# EasyEDA Pro project Project-File_Cpeedo-mk5.epro, board PCB1
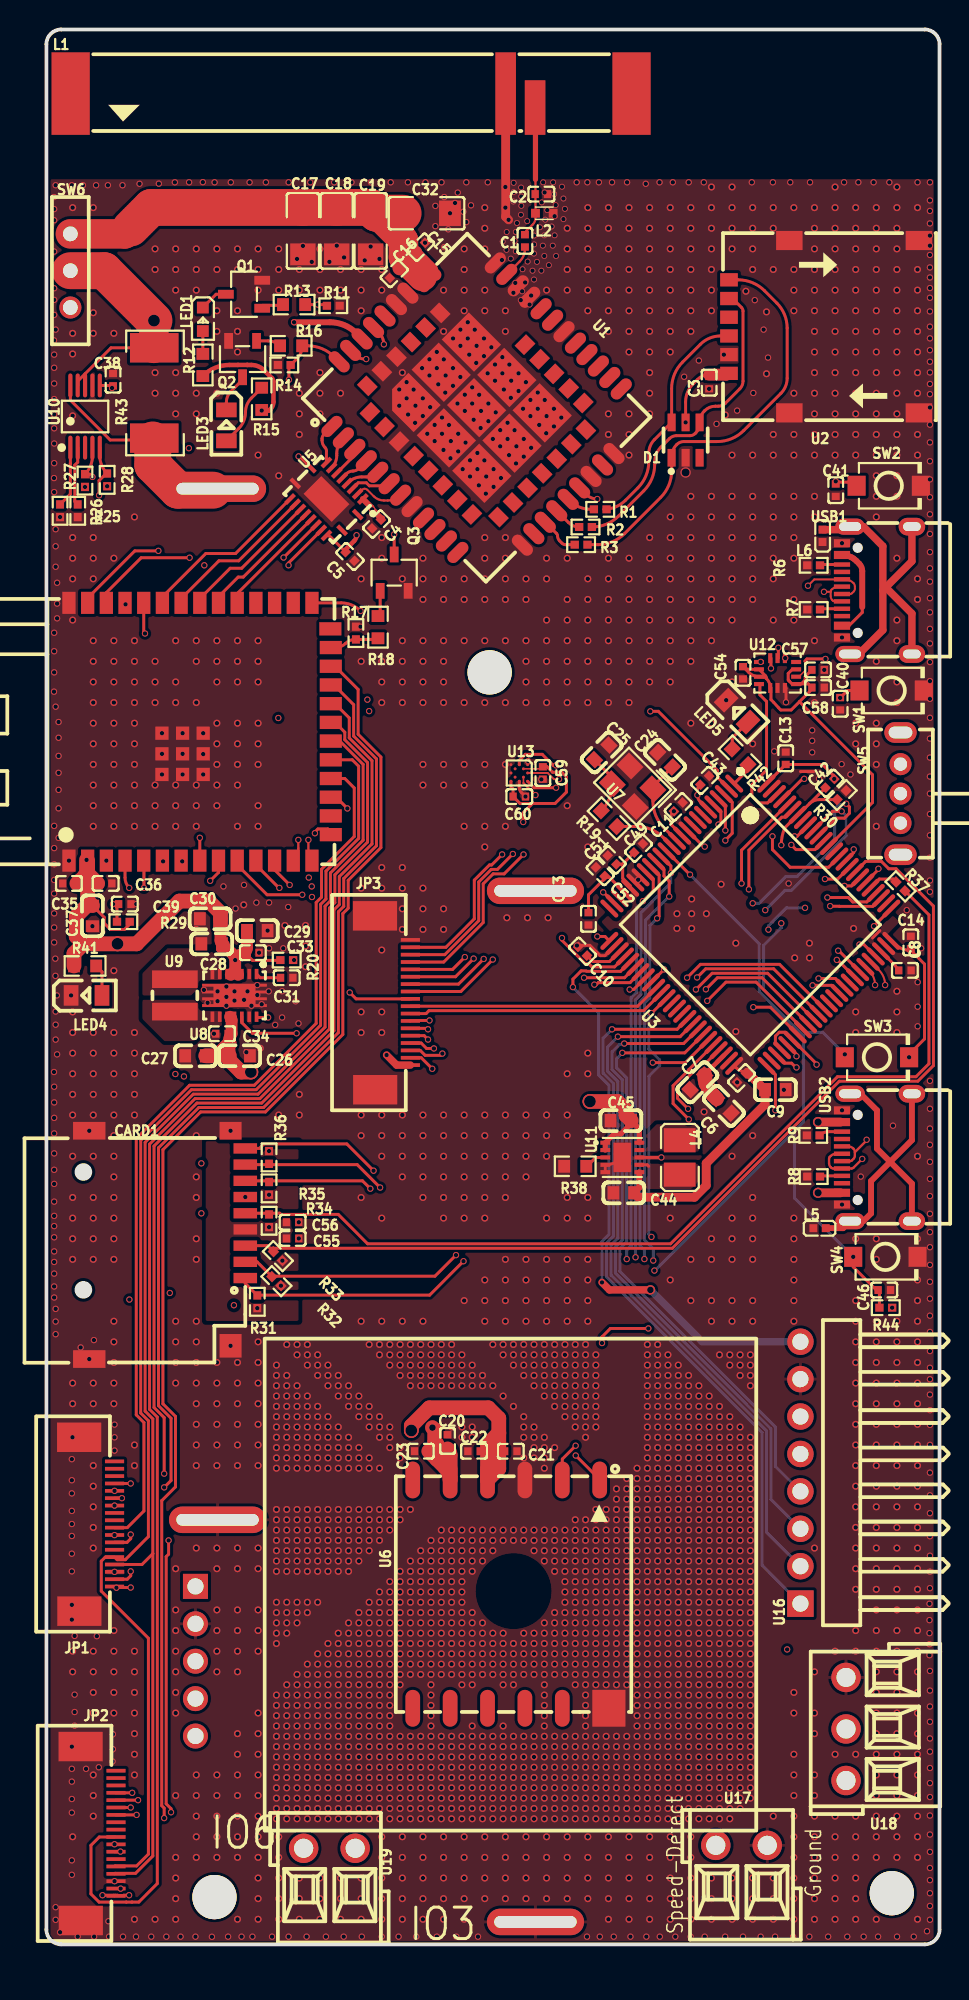
[diagram p5: board, top side]
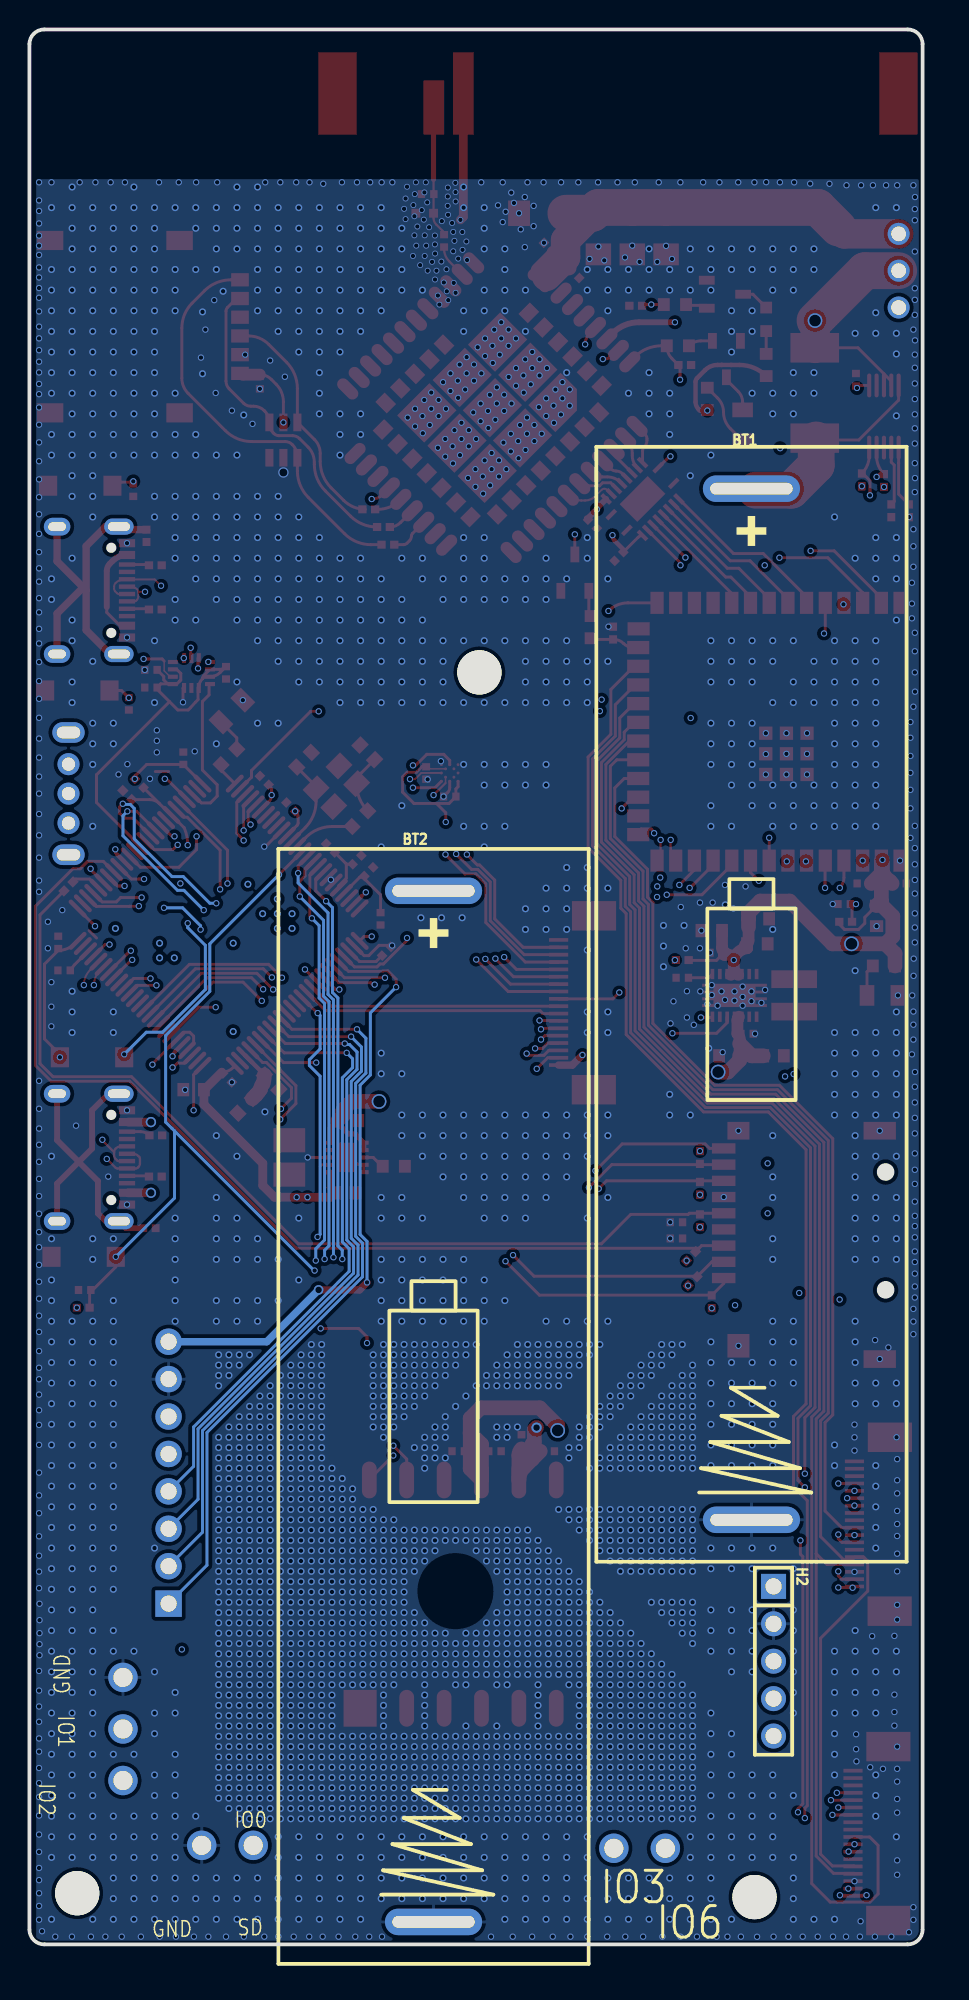
[diagram p6: board, bottom side, seen from below]

Outline 60.68 x 130 mm; copper layers: Top Layer, Inner1, Inner2, Inner3, Inner4, Bottom Layer. Coordinates in mm from the lower left corner of the outline.
Outline path: 0,129 0,1 arc(0.29,0.29) 1,0 59.68,0 arc(60.39,0.29) 60.68,1 60.68,129 arc(60.39,129.71) 59.68,130 1,130 arc(0.29,129.71) 0,129
Stack: Top Layer 0.035mm Outer layer thickness 1oz / Dielectric1 0.0994mm 3313 RC57% 4.2mil / Inner1 0.0152mm Inner layer thickness / Dielectric2 0.55mm 0.55mm H/H No copper / Inner2 0.0152mm Inner layer thickness / Dielectric3 0.1164mm 2116 RC54% 4.9mil / Inner3 0.0152mm Inner layer thickness / Dielectric4 0.55mm 0.55mm H/H No copper / Inner4 0.0152mm Inner layer thickness / Dielectric5 0.0994mm 3313 RC57% 4.2mil / Bottom Layer 0.035mm Outer layer thickness 1oz

## Design rules (mm)
net USB_ESP32_D-: DP1
net USB_ESP32_D+: DP1
net STM32_DN: DP2
net STM32_DP: DP2
template: Custom Config
spacing copperThickness1oz (default): track to track 0.102, other pairs 0.1 to 0.3
spacing copperThickness2oz: track to track 0.203, other pairs 0.152 to 0.3
track width copperThickness1oz (default): min 0.08, default 0.2, max 2.54
track width copperThickness2oz: min 0.203, default 0.254, max 2.54
differential pair differentialPair (default): width min 0.127, default 0.133, max 2.54; gap min 0.152, default 0.2
via viaSize (default): diameter min 0.4, default 0.43, max 10; hole min 0.3, default 0.3, max 6.3
pour e26 uses copperRegion1

## Placement (name value [footprint] x y rotation side)
BT1  BH-18650-A1AJ006  [BAT-TH_BH-18650-A1AJ006]  11.63 63.82 90 bottom
BT2  BH-18650-A1AJ006  [BAT-TH_BH-18650-A1AJ006]  33.23 36.52 90 bottom
C1  2.7pF  [C0402]  32.51 115.65 90 top
C2  0.5pF  [C0402]  33.63 118.82 180 top
C3  100nF  [C0402]  45.03 106.02 90 top
C4  100nF  [C0402]  22.43 96.42 45 top
C5  100nF  [C0402]  20.63 94.22 135 top
C6  2.2uF  [C0603]  46.03 56.92 135 top
C7  2.2uF  [C0603]  44.23 58.52 45 top
C8  100nF  [C0402]  58.33 66.12 180 top
C9  10uF  [C0603]  49.53 58.02 180 top
C10  100nF  [C0402]  36.43 67.42 315 top
C11  100nF  [C0402]  42.93 77.22 225 top
C12  100nF  [C0402]  47.23 58.82 45 top
C13  100nF  [C0402]  50.23 80.52 270 top
C14  100nF  [C0402]  58.73 68.02 270 top
C15  100nF  [C0402]  25.43 115.22 225 top
C16  1uF  [C0402]  23.63 113.42 45 top
C17  100uF  [C1206]  17.43 116.32 90 top
C18  100uF  [C1206]  19.73 116.32 90 top
C19  100uF  [C1206]  22.03 116.32 90 top
C20  100nF  [C0402]  27.25 34.18 270 top
C21  100nF  [C0402]  31.55 33.48 180 top
C22  10uF  [C0402]  29.05 33.48 0 top
C23  4.7uF  [C0402]  25.43 33.48 0 top
C24  15pF  [C0603]  42.03 80.42 315 top
C25  15pF  [C0603]  37.73 80.92 225 top
C26  10uF  [C0603]  13.13 60.32 180 top
C27  10uF  [C0603]  10.13 60.32 0 top
C28  22uF  [C0603]  11.23 67.92 0 top
C29  22uF  [C0603]  14.33 68.82 180 top
C30  22uF  [C0603]  11.13 69.62 0 top
C31  100nF  [C0402]  16.33 65.62 180 top
C32  100uF  [C1206]  25.83 117.52 180 top
C33  100nF  [C0402]  14.03 67.32 180 top
C34  100nF  [C0402]  11.93 61.82 0 top
C35  100nF  [C0402]  1.53 72.02 0 top
C36  10uF  [C0402]  4.03 72.02 180 top
C37  22uF  [C0603]  3.13 69.82 90 top
C38  100nF  [C0402]  4.53 106.22 270 top
C39  1uF  [C0402]  5.33 70.62 180 top
C40  100nF  [C0402]  53.93 84.22 90 top
C41  100nF  [C0402]  53.63 98.72 90 top
C42  100nF  [C0402]  53.23 78.82 225 top
C43  100nF  [C0402]  44.73 79.02 225 top
C44  22uF  [C0603]  39.23 51.02 0 top
C45  10uF  [C0603]  39.03 55.92 0 top
C46  100nF  [C0402]  56.93 44.42 180 top
C49  1uF  [C0402]  40.23 74.42 225 top
C51  1uF  [C0402]  38.43 73.62 315 top
C52  100nF  [C0402]  37.63 72.82 135 top
C53  100nF  [C0402]  36.83 69.62 270 top
C54  100nF  [C0402]  47.33 86.32 90 top
C55  100nF  [C0402]  16.73 47.92 180 top
C56  1uF  [C0402]  16.73 49.02 180 top
C57  100nF  [C0402]  52.43 86.52 180 top
C58  2.2uF  [C0402]  52.43 85.32 180 top
C59  100nF  [C0402]  33.73 79.52 90 top
C60  100nF  [C0402]  32.13 77.92 180 top
CARD1  TF PUSH  [TF-SMD_TF-PUSH]  8.21 47.48 270 top
D1  SRV05-4  [SOT-23-6_L2.9-W1.6-P0.95-LS2.8-BL-1]  43.43 102.12 0 top
H2  PZ254V-11-05P  [HDR-TH_5P-P2.54-V-M]  10.13 19.22 270 bottom
JP1  AFC07-S18FCC-00  [FPC-SMD_AFC07-S18FCC-00]  3.43 28.52 270 top
JP2  AFC07-S18FCC-00  [FPC-SMD_AFC07-S18FCC-00]  3.53 7.52 270 top
JP3  AFC07-S18FCC-00  [FPC-SMD_AFC07-S18FCC-00]  23.53 63.92 270 top
L1  1462000001  [ANT-SMD_L40.0-W5.0_1462000001]  20.7 125.17 0 top
L2  7.5nH  [IND-SMD_L1.2-W0.6]  33.83 117.52 0 top
L4  2.2uH  [L1008]  43.03 53.42 270 top
L5  BLM15AX102SN1D  [L0402]  52.53 48.62 0 top
L6  BLM15AX102SN1D  [L0402]  52.73 95.62 90 top
LED1  KT-0603R  [LED0603-RD]  10.63 110.32 270 top
LED3  KT-0805G  [LED0805-R-RD]  12.23 103.12 270 top
LED4  KT-0805G  [LED0805-R-RD]  2.73 64.42 0 top
LED5  KT-0805G  [LED0805-R-RD]  46.93 83.72 315 top
NOREF  -  [Pad_e88905]  57.43 3.47 0 top
NOREF#2  -  [Pad_e88906]  11.42 3.21 0 top
NOREF#3  -  [Pad_e88904]  30.11 86.35 0 top
Q1  BSS138  [SOT-23-3_L2.9-W1.6-P1.90-LS2.8-BR]  13.43 112.02 0 top
Q2  BSS138  [SOT-23-3_L2.9-W1.6-P1.90-LS2.8-BR]  13.33 107.62 90 top
Q3  BSS138  [SOT-23-3_L2.9-W1.6-P1.90-LS2.8-BR]  23.63 93.12 270 top
R1  22Ω  [R0402]  37.63 97.42 180 top
R2  22Ω  [R0402]  36.63 96.22 180 top
R3  22Ω  [R0402]  36.33 95.02 180 top
R6  5.1kΩ  [R0402]  52.13 93.62 0 top
R7  5.1kΩ  [R0402]  52.13 90.62 0 top
R8  5.1kΩ  [R0402]  52.13 52.12 0 top
R9  5.1kΩ  [R0402]  52.1 54.92 0 top
R11  10kΩ  [R0402]  19.49 111.24 180 top
R12  680Ω  [R0603]  10.63 107.22 270 top
R13  680Ω  [R0603]  16.83 111.32 0 top
R14  10kΩ  [R0402]  16.16 107.22 0 top
R15  680Ω  [R0603]  14.63 104.92 270 top
R16  680Ω  [R0603]  16.63 108.52 0 top
R17  10kΩ  [R0402]  21.03 89.02 270 top
R18  680Ω  [R0603]  22.53 89.42 270 top
R19  1kΩ  [R0603]  38.23 76.42 315 top
R20  100kΩ  [R0402]  16.33 66.82 180 top
R25  10kΩ  [R0402]  0.93 97.32 90 top
R26  10kΩ  [R0402]  2.13 97.32 90 top
R27  10kΩ  [R0402]  2.62 99.38 270 top
R28  10kΩ  [R0402]  4.13 99.42 270 top
R29  10kΩ  [R0402]  5.23 69.42 180 top
R30  10kΩ  [R0402]  54.03 78.02 225 top
R31  10kΩ  [R0402]  14.33 43.62 270 top
R32  10kΩ  [R0402]  15.63 45.02 315 top
R33  10kΩ  [R0402]  15.73 46.72 315 top
R34  10kΩ  [R0402]  15.13 49.12 270 top
R35  10kΩ  [R0402]  15.13 51.32 270 top
R36  10kΩ  [R0402]  15.13 53.42 90 top
R37  33Ω  [R0402]  58.03 71.82 135 top
R38  36.5kΩ  [R0603]  35.93 52.82 0 top
R41  680Ω  [R0603]  2.63 66.42 0 top
R42  680Ω  [R0603]  47.13 80.62 135 top
R43  20mΩ  [RES-SMD_L6.4-W3.2-R2512]  7.33 105.32 270 top
R44  10kΩ  [R0402]  57.03 43.22 0 top
SW1  TS-1088-AR02016  [SW-SMD_L3.9-W3.0-P4.45]  57.43 85.12 0 top
SW2  TS-1088-AR02016  [SW-SMD_L3.9-W3.0-P4.45]  57.23 99.02 0 top
SW3  TS-1088-AR02016  [SW-SMD_L3.9-W3.0-P4.45]  56.43 60.22 0 top
SW4  TS-1088-AR02016  [SW-SMD_L3.9-W3.0-P4.45]  57 46.68 0 top
SW5  SK12D07VG4  [SW-TH_SK12D07VG4-1]  58.03 78.12 90 top
SW6  K3-1204D  [SW-TH_K3-1204D]  1.63 113.62 270 top
U1  SIM7080G  [LCC-SMD_SIM7080G]  29.23 104.32 45 top
U2  NANO SIM XG6P H1.35  [SIM-SMD_NANO-SIM-XG6P-H1.35]  52.83 109.82 90 top
U3  STM32U575VGT6  [LQFP-100_L14.0-W14.0-P0.50-LS16.0-BL]  47.83 69.22 225 top
U4  ESP32-S3-WROOM-1-N16R8  [WIRELM-SMD_ESP32-S3-WROOM-1]  10.43 82.32 90 top
U5  TXB0108RGYR  [VQFN-20_L4.5-W3.5-P0.50-BL-EP]  19.03 98.12 135 top
U6  L80RE-M37  [GPSM-SMD_12P-L16.0-W16.0-P2.54-BL]  31.55 23.78 180 top
U7  ABM8-272-T3  [CRYSTAL-SMD_4P-L3.2-W2.5-BL]  39.83 78.62 135 top
U8  TPS63021DSJR  [VSON-14_L4.0-W3.0-P0.50-BL-EP_TI_DSJ]  12.78 64.42 180 top
U9  1.5uH  [IND-SMD_L3.0-W3.0_FTC303020D]  8.73 64.42 90 top
U10  INA226AIDGSR  [MSOP-10_L3.0-W3.0-P0.50-LS5.0-BL]  2.63 103.72 0 top
U11  TPS63900DSKR  [WSON-10_L2.5-W2.5-W0.50-TL-EP]  39.13 53.42 0 top
U12  ICM-42688-PC  [LGA-14_L3.0-W2.5-P0.50-TL]  49.67 86.31 0 top
U13  BMM150  [WLCSP-12_L1.6-W1.6_BMM150]  32.13 79.52 0 top
U16  2541WR-08P  [HDR-TH_8P-P2.54-H-M-W10.4]  51.23 32.02 90 top
U17  KF350R-3.5-2P  [CONN-TH_P3.50_KF396R-3.5-2P]  47.23 6.72 0 top
U18  KF350R-3.5-3P  [CONN-TH_3P-P3.50_KF396R-3.5-3P]  54.33 14.62 90 top
U19  KF350R-3.5-2P  [CONN-TH_P3.50_KF396R-3.5-2P]  19.23 6.52 0 top
USB1  TYPE-C 16PIN 2MD(073)  [USB-C-SMD_TYPE-C-6PIN-2MD-073]  56.43 91.92 90 top
USB2  TYPE-C 16PIN 2MD(073)  [USB-C-SMD_TYPE-C-6PIN-2MD-073]  56.43 53.42 90 top

## Footprints (pads in the part's own frame, mm; a bottom-side part is the same pattern mirrored in y, then rotated)
ANT-SMD_L40.0-W5.0_1462000001
  rect 2.6x5.6 smd: 1(-19.054,0.475) 4(19.054,0.475)
  rect 1.4x5.6 smd: 2(10.5,0.475)
  rect 1.4x3.7 smd: 3(12.5,-0.475)
BAT-TH_BH-18650-A1AJ006
  oval 1.8x6.6 hole 0.8x5.6: 1(-35,0) 2(35,0)
C0402
  rect 0.5x0.54 smd: 1(-0.42,0) 2(0.42,0)
C0603
  rect 0.8x0.9 smd: 1(-0.7,0) 2(0.7,0)
C1206
  rect 1.485x1.728 smd: 1(-1.593,0) 2(1.593,0)
CONN-TH_3P-P3.50_KF396R-3.5-3P
  round 2 hole 1.3: 1(-3.5,0) 2(0,0) 3(3.5,0)
CONN-TH_P3.50_KF396R-3.5-2P
  round 2 hole 1.3: 1(-1.75,0) 2(1.75,0)
CRYSTAL-SMD_4P-L3.2-W2.5-BL
  rect 1.4x1.2 smd: 1(-1.1,-0.85) 2(1.1,-0.85) 3(1.1,0.85) 4(-1.1,0.85)
FPC-SMD_AFC07-S18FCC-00
  rect 0.25x1.3 smd: 1(4.231,1.202) 2(3.734,1.202) 3(3.234,1.202) 4(2.734,1.202) 5(2.234,1.202) 6(1.734,1.202) 7(1.232,1.204) 8(0.733,1.204) 9(0.233,1.203) 10(-0.267,1.203) 11(-0.765,1.202) 12(-1.266,1.202) 13(-1.768,1.202) 14(-2.266,1.202) 15(-2.766,1.202) 16(-3.266,1.202) 17(-3.766,1.202) 18(-4.268,1.202)
  rect 2x3 smd: 19(-5.904,-1.204) 20(5.904,-1.19)
GPSM-SMD_12P-L16.0-W16.0-P2.54-BL
  oval 1x2.5 smd: 1(-6.037,-7.75) 2(-3.498,-7.75) 3(-0.958,-7.75) 4(1.583,-7.75) 5(4.122,-7.75) 6(6.662,-7.75) 7(6.662,7.75) 8(4.122,7.75) 9(1.583,7.75) 10(-0.958,7.75) 11(-3.498,7.75)
  rect 2.25x2.5 smd: 12(-6.662,7.75)
HDR-TH_5P-P2.54-V-M
  rect 1.7x1.7 hole 1.1: 1(-5.08,0)
  round 1.7 hole 1.1: 2(-2.54,0) 3(0,0) 4(2.54,0) 5(5.08,0)
HDR-TH_8P-P2.54-H-M-W10.4
  rect 1.8x1.8 hole 1.1: 1(-8.89,0)
  round 1.8 hole 1.1: 2(-6.35,0) 3(-3.81,0) 4(-1.27,0) 5(1.27,0) 6(3.81,0) 7(6.35,0) 8(8.89,0)
IND-SMD_L1.2-W0.6
  rect 0.6x0.6 smd: 1(-0.6,0) 2(0.6,0)
IND-SMD_L3.0-W3.0_FTC303020D
  rect 1.2x3.1 smd: 1(-1.1,0) 2(1.1,0)
L0402
  rect 0.54x0.54 smd: 1(-0.42,0) 2(0.42,0)
L1008
  rect 1.635x2.16 smd: 1(-1.167,0) 2(1.167,0)
LCC-SMD_SIM7080G
  oval 1.7x0.8 smd: 1(-7.85,6.05) 2(-7.85,4.95) 3(-7.85,3.85) 4(-7.85,2.75) 5(-7.85,1.65) 6(-7.85,0.55) 7(-7.85,-0.55) 8(-7.85,-1.65) 9(-7.85,-2.75) 10(-7.85,-3.85) 11(-7.85,-4.95) 12(-7.85,-6.05) 22(7.85,-6.05) 23(7.85,-4.95) 24(7.85,-3.85) 25(7.85,-2.75) 26(7.85,-1.65) 27(7.85,-0.55) 28(7.85,0.55) 29(7.85,1.65) 30(7.85,2.75) 31(7.85,3.85) 32(7.85,4.95) 33(7.85,6.05)
  oval 0.8x1.7 smd: 13(-4.4,-8.8) 14(-3.3,-8.8) 15(-2.2,-8.8) 16(-1.1,-8.8) 17(0,-8.8) 18(1.1,-8.8) 19(2.2,-8.8) 20(3.3,-8.8) 21(4.4,-8.8) 34(4.4,8.8) 35(3.3,8.8) 36(2.2,8.8) 37(1.1,8.8) 38(0,8.8) 39(-1.1,8.8) 40(-2.2,8.8) 41(-3.3,8.8) 42(-4.4,8.8)
  rect 1.1x0.9 smd: 43(-5.35,4.9) 44(-5.35,3.5) 45(-5.35,2.1) 46(-5.35,0.7) 47(-5.35,-0.7) 48(-5.35,-2.1) 49(-5.35,-3.5) 50(-5.35,-4.9) 58(5.35,-4.9) 59(5.35,-3.5) 60(5.35,-2.1) 61(5.35,-0.7) 62(5.35,0.7)
  rect 0.9x1.1 smd: 51(-4.2,-6.3) 52(-2.8,-6.3) 53(-1.4,-6.3) 54(0,-6.3) 55(1.4,-6.3) 56(2.8,-6.3) 57(4.2,-6.3) 63(2.8,6.3) 64(1.4,6.3) 65(0,6.3) 66(-1.4,6.3) 67(-2.8,6.3) 68(-4.2,6.3)
  custom 2.6x3.1 smd: 69(-2.9,3.4)
  rect 2.6x3.1 smd: 70(-2.9,0) 71(-2.9,-3.4) 72(0,-3.4) 73(2.9,-3.4) 74(2.9,0) 75(2.9,3.4) 76(0,3.4) 77(0,0)
LED0603-RD
  rect 0.8x0.8 smd: 1(-0.799,0) 2(0.799,0)
LED0805-R-RD
  rect 1x1.399 smd: 1(1.05,0) 2(-1.05,0)
LGA-14_L3.0-W2.5-P0.50-TL
  rect 0.675x0.28 smd: 1(-1.262,0.75) 2(-1.262,0.25) 3(-1.262,-0.25) 4(-1.262,-0.75) 8(1.262,-0.75) 9(1.262,-0.25) 10(1.262,0.25) 11(1.262,0.75)
  rect 0.28x0.675 smd: 5(-0.5,-1.012) 6(0,-1.012) 7(0.5,-1.012) 12(0.5,1.012) 13(0,1.012) 14(-0.5,1.012)
LQFP-100_L14.0-W14.0-P0.50-LS16.0-BL
  oval 0.3x1.6 smd: 1(-6,-7.55) 2(-5.5,-7.55) 3(-5,-7.55) 4(-4.5,-7.55) 5(-4,-7.55) 6(-3.5,-7.55) 7(-3,-7.55) 8(-2.5,-7.55) 9(-2,-7.55) 10(-1.5,-7.55) 11(-1,-7.55) 12(-0.5,-7.55) 13(0,-7.55) 14(0.5,-7.55) 15(1,-7.55) 16(1.5,-7.55) 17(2,-7.55) 18(2.5,-7.55) 19(3,-7.55) 20(3.5,-7.55) 21(4,-7.55) 22(4.5,-7.55) 23(5,-7.55) 24(5.5,-7.55) 25(6,-7.55) 51(6,7.55) 52(5.5,7.55) 53(5,7.55) 54(4.5,7.55) 55(4,7.55) 56(3.5,7.55) 57(3,7.55) 58(2.5,7.55) 59(2,7.55) 60(1.5,7.55) 61(1,7.55) 62(0.5,7.55) 63(0,7.55) 64(-0.5,7.55) 65(-1,7.55) 66(-1.5,7.55) 67(-2,7.55) 68(-2.5,7.55) 69(-3,7.55) 70(-3.5,7.55) 71(-4,7.55) 72(-4.5,7.55) 73(-5,7.55) 74(-5.5,7.55) 75(-6,7.55)
  oval 1.6x0.3 smd: 26(7.55,-6) 27(7.55,-5.5) 28(7.55,-5) 29(7.55,-4.5) 30(7.55,-4) 31(7.55,-3.5) 32(7.55,-3) 33(7.55,-2.5) 34(7.55,-2) 35(7.55,-1.5) 36(7.55,-1) 37(7.55,-0.5) 38(7.55,0) 39(7.55,0.5) 40(7.55,1) 41(7.55,1.5) 42(7.55,2) 43(7.55,2.5) 44(7.55,3) 45(7.55,3.5) 46(7.55,4) 47(7.55,4.5) 48(7.55,5) 49(7.55,5.5) 50(7.55,6) 76(-7.55,6) 77(-7.55,5.5) 78(-7.55,5) 79(-7.55,4.5) 80(-7.55,4) 81(-7.55,3.5) 82(-7.55,3) 83(-7.55,2.5) 84(-7.55,2) 85(-7.55,1.5) 86(-7.55,1) 87(-7.55,0.5) 88(-7.55,0) 89(-7.55,-0.5) 90(-7.55,-1) 91(-7.55,-1.5) 92(-7.55,-2) 93(-7.55,-2.5) 94(-7.55,-3) 95(-7.55,-3.5) 96(-7.55,-4) 97(-7.55,-4.5) 98(-7.55,-5) 99(-7.55,-5.5) 100(-7.55,-6)
MSOP-10_L3.0-W3.0-P0.50-LS5.0-BL
  oval 0.28x1.62 smd: 1(-1,-2.11) 2(-0.5,-2.11) 3(0,-2.11) 4(0.5,-2.11) 5(1,-2.11) 6(1,2.11) 7(0.5,2.11) 8(0,2.11) 9(-0.5,2.11) 10(-1,2.11)
Pad_e88904
  round 3 hole 3: 1(0,0)
Pad_e88905
  round 3 hole 3: 1(0,0)
Pad_e88906
  round 3 hole 3: 1(0,0)
R0402
  rect 0.566x0.54 smd: 1(-0.433,0) 2(0.433,0)
R0603
  rect 0.806x0.864 smd: 1(-0.753,0) 2(0.753,0)
RES-SMD_L6.4-W3.2-R2512
  rect 2x3.3 smd: 1(-3.067,0) 2(3.067,0)
SIM-SMD_NANO-SIM-XG6P-H1.35
  rect 0.9x1.2 smd: 1(-3.17,6.45) 2(-0.63,6.45) 3(1.91,6.45) 5(-1.9,6.45) 6(0.64,6.45) 7(3.18,6.45)
  rect 1.3x1.8 smd: 8(-5.85,2.35) 9(-5.85,-6.45) 10(5.85,-6.45) 11(5.85,2.35)
SOT-23-3_L2.9-W1.6-P1.90-LS2.8-BR
  rect 1.07x0.6 smd: 1(1.235,-0.95) 2(1.235,0.95) 3(-1.235,0)
SOT-23-6_L2.9-W1.6-P0.95-LS2.8-BL-1
  rect 0.55x1.2 smd: 1(-0.95,-1.2) 2(0,-1.2) 3(0.95,-1.2) 4(0.95,1.2) 5(0,1.2) 6(-0.95,1.2)
SW-SMD_L3.9-W3.0-P4.45
  rect 1.23x1.36 smd: 1(-2.185,0) 2(2.185,0)
SW-TH_K3-1204D
  round 1.5 hole 1: 1(-2.5,0) 2(0,0) 3(2.5,0)
SW-TH_SK12D07VG4-1
  round 1.5 hole 0.9: 1(-2,0) 2(0,0) 3(2,0)
  oval 1.4x2.2 hole 0.8x1.6: 4(4.15,0) 5(-4.15,0)
TF-SMD_TF-PUSH
  rect 0.7x1.6 smd: 1(2.25,5.3) 2(1.15,5.3) 3(0.05,5.3) 4(-1.05,5.3) 5(-2.15,5.3) 6(-3.25,5.3) 7(-4.35,5.3) 8(-5.45,5.3) CD(-6.55,5.3)
  rect 1.2x1.5 smd: 10(-7.75,4.3)
  rect 1.2x2.2 smd: 11(-7.75,-5.3) 12(7.75,-5.3)
  rect 1.6x1.5 smd: 13(6.85,4.3)
USB-C-SMD_TYPE-C-6PIN-2MD-073
  rect 0.55x1.1 smd: 1(-3.2,2.375) 2(-2.4,2.375) 11(2.4,2.375) 12(3.2,2.375)
  rect 0.3x1.1 smd: 3(-1.75,2.375) 4(-1.25,2.375) 5(-0.75,2.375) 6(-0.25,2.375) 7(0.25,2.375) 8(0.75,2.375) 9(1.25,2.375) 10(1.75,2.375)
  oval 1.1x2 hole 0.6x1.5: 13(-4.325,1.825) 14(4.325,1.825)
  oval 1.2x1.8 hole 0.6x1.2: 13(-4.325,-2.375) 14(4.325,-2.375)
VQFN-20_L4.5-W3.5-P0.50-BL-EP
  rect 0.85x0.28 smd: 1(-2.25,-0.752) 10(2.25,-0.752) 11(2.25,0.748) 20(-2.25,0.75)
  rect 0.28x0.85 smd: 2(-1.748,-1.75) 3(-1.248,-1.75) 4(-0.749,-1.75) 5(-0.248,-1.75) 6(0.251,-1.75) 7(0.751,-1.75) 8(1.252,-1.75) 9(1.752,-1.75) 12(1.752,1.75) 13(1.252,1.75) 14(0.75,1.748) 15(0.25,1.748) 16(-0.25,1.748) 17(-0.75,1.748) 18(-1.25,1.748) 19(-1.75,1.748)
  rect 2.7x1.7 smd: 21(0,-0.002)
VSON-14_L4.0-W3.0-P0.50-BL-EP_TI_DSJ
  rect 0.25x0.7 smd: 1(-1.5,-1.45) 2(-1,-1.45) 3(-0.5,-1.45) 4(0,-1.45) 5(0.5,-1.45) 6(1,-1.45) 7(1.5,-1.45) 8(1.5,1.45) 9(1,1.45) 10(0.5,1.45) 11(0,1.45) 12(-0.5,1.45) 13(-1,1.45) 14(-1.5,1.45)
  custom 4.4x1.58 smd: 15(0,0)
WIRELM-SMD_ESP32-S3-WROOM-1
  rect 1.5x0.9 smd: 1(-8.75,8.895) 2(-8.75,7.625) 3(-8.75,6.355) 4(-8.75,5.085) 5(-8.75,3.815) 6(-8.75,2.545) 7(-8.75,1.275) 8(-8.75,0.005) 9(-8.75,-1.265) 10(-8.75,-2.535) 11(-8.75,-3.805) 12(-8.75,-5.075) 13(-8.75,-6.345) 14(-8.75,-7.615) 27(8.75,-7.615) 28(8.75,-6.345) 29(8.75,-5.075) 30(8.75,-3.805) 31(8.75,-2.535) 32(8.75,-1.265) 33(8.75,0.005) 34(8.75,1.275) 35(8.75,2.545) 36(8.75,3.815) 37(8.75,5.085) 38(8.75,6.355) 39(8.75,7.625) 40(8.75,8.895)
  rect 0.9x1.5 smd: 15(-6.985,-8.895) 16(-5.715,-8.895) 17(-4.445,-8.895) 18(-3.175,-8.895) 19(-1.905,-8.895) 20(-0.635,-8.895) 21(0.635,-8.895) 22(1.905,-8.895) 23(3.175,-8.895) 24(4.445,-8.895) 25(5.715,-8.895) 26(6.985,-8.865)
  rect 0.9x0.9 smd: 41(-2.9,2.575) 41(-2.9,1.175) 41(-2.9,-0.225) 41(-1.5,2.575) 41(-1.5,1.175) 41(-1.5,-0.225) 41(-0.1,2.575) 41(-0.1,1.175) 41(-0.1,-0.225)
WLCSP-12_L1.6-W1.6_BMM150
  round 0.2 smd: A1(0.566,0.566) A3(0.566,0) A5(0.566,-0.566) B2(0.283,0.283) B4(0.283,-0.283) C1(0,0.566) C5(0,-0.566) D2(-0.283,0.283) D4(-0.283,-0.283) E1(-0.566,0.566) E3(-0.566,0) E5(-0.566,-0.566)
WSON-10_L2.5-W2.5-W0.50-TL-EP
  rect 0.665x0.28 smd: 1(-1.157,1) 2(-1.157,0.5) 3(-1.157,0) 4(-1.157,-0.5) 5(-1.157,-1) 6(1.157,-1) 7(1.157,-0.5) 8(1.157,0) 9(1.157,0.5) 10(1.157,1)
  rect 1.2x2 smd: 11(0,0)

## Nets
As in the schematic, except:
VBAT: C20.2 C23.2 C26.2 C27.2 C34.2 C45.2 R43.1 SW5.3 SW6.2 U6.5 U8.10 U8.11 U10.8 U10.9 U11.1 U11.2 U11.10
PB0: JP3.9 U3.35
PB1: JP3.8 U3.36
PB4: JP3.12 U3.90
PB5: JP3.11 U3.91
PB8: JP3.13 U3.95
PB9: JP3.14 U3.96
PB15: JP3.7 U3.62
PE4: JP3.15 U3.3
PE5: JP3.16 U3.4
PE6: JP3.17 U3.5
SIM_VDD: C3.2 D1.5 U1.18 U2.1

Pads without a net: D1 3; JP1 6 10 11 16 17 18; JP2 6 10 11 16 17 18; L1 1 4; NOREF 1; NOREF#2 1; NOREF#3 1; SW5 4 5; SW6 3; U1 9 10 11 12 14 20 22 23 24 25 26 28 29 38 43 44 46 47 48 49 50 51 52 53 54 55 56 57 58 59 60 61 62 64 65 68; U2 6; U3 7 8 9 23 25 38 39 40 52 63 64 67 77 87 93; U4 16 26 28 29 30; U5 1 20; U6 6 7 8 9 10 11; U10 3; U12 11; U13 D2 D4; USB1 3 9; USB2 3 9

## Via types
v1: diameter 0.43, hole 0.3, Top Layer to Bottom Layer, 734 vias
v2: diameter 0.48, hole 0.3, Top Layer to Bottom Layer, 2675 vias
v3: diameter 0.4, hole 0.3, Top Layer to Bottom Layer, 56 vias
v4: diameter 0.7, hole 0.55, Top Layer to Bottom Layer, 1 via
v5: diameter 1, hole 0.8, Top Layer to Bottom Layer, 5 vias
v6: diameter 0.7, hole 0.5, Top Layer to Bottom Layer, 2 vias
v7: diameter 0.7, hole 0.45, Top Layer to Bottom Layer, 1 via
v8: diameter 0.65, hole 0.45, Top Layer to Bottom Layer, 1 via

## Routing (per net, layer and track width the routed paths; a pad name or vN(x,y) marks a point on that pad's centre or on a via; arc(x,y) is an arc through that point)
3.7V: length 31.5
  Top Layer w1: U1.34 25.12,114.66 arc(25.06,114.74) 25.04,114.84 ; 24.69,113.53 arc(24.38,113.74) 24.01,113.81
  Top Layer w2: SW6.1 5.33,116.12 5.73,116.52 ; 25.54,113.24 24.26,114.53 24.26,115.69 22.42,117.52
  Top Layer w2.5: C32.2 22.42,117.52 C19.2 C18.2 C17.2 7.12,117.92 5.73,116.52
GND: length 20.3
  Top Layer w0.2: U3.20 v1(40.2,72.28) 40.37,72.44 ; U4.41 v1(10.65,80.81) ; U11.5 U11.4 arc(38.58,53.04) 39.09,53.39 U11.11 ; U13.C5 32.13,78.52 arc(32.16,78.36) 32.25,78.22 v1(32.55,77.92) ; U3.10 44.59,74.58 arc(44.65,74.54) v1(44.73,74.52) ; v1(50.25,84.32) 50.25,85.27 arc(50.24,85.3) 50.23,85.32 ; U11.8 v1(41.78,53.42) ; U3.27 37.95,67.12 37.63,67.12 36.93,67.82 36.06,67.82 v1(36.04,67.81) ; 51.23,79.62 52.13,79.62
  Top Layer w0.6: L1.2 31.2,117.28 v3(31.4,117.08)
  vias: v1(0.52,118.62) v1(0.53,117.81) v1(0.53,117.05) v1(0.53,114.92) v1(0.53,112.43) v1(0.53,111.64) v1(0.53,110.62) v1(0.52,108.89) v1(0.53,107.93) v1(0.53,107.03) v1(0.53,105.96) v1(0.53,104.91) v1(0.53,103.87) v1(0.53,102.92) v1(0.53,101.89) v1(0.53,100.56) v1(0.52,99.54) v1(0.53,98.59) v1(0.53,89.04) v1(0.53,87.79) v1(0.53,86.35) v1(0.52,85.04) v1(0.53,75.93) v1(0.53,74.42) v1(0.53,73.32) v1(0.53,72.26) v1(0.53,71.34) v1(0.53,69.99) v1(0.53,69.03) v1(0.53,68.02) v1(0.52,59.22) v1(0.53,58.22) v1(0.53,57.16) v1(0.53,56.11) v1(0.53,55.05) v1(0.53,53.7) v1(0.53,52.58) v1(0.53,51.63) v1(0.53,50.42) v1(0.53,49.46) v1(0.53,48.76) v1(0.53,48) v1(0.53,47.04) v1(0.53,46.33) v1(0.53,45.54) v1(0.53,44.66) v1(0.53,43.91) v1(0.63,119.42) v1(0.63,109.62) v1(0.63,96.07) v1(0.63,94.91) v1(0.63,93.52) v1(0.63,84.02) v1(0.6,66.92) v1(0.61,65.75) v1(0.63,63.33) v1(0.63,62.43) v1(0.63,61.42) v1(0.63,43.14) v1(0.63,42.28) v1(0.63,41.42) v1(0.63,2.52) v1(0.63,1.67) v1(0.73,92.44) v1(0.73,91.02) v1(0.73,90.02) v1(0.71,64.42) v1(0.73,60.42) v1(0.83,82.98) v1(0.83,81.91) v1(0.83,80.68) v1(0.83,79.53) v1(0.83,78.38) v1(0.83,77.12) v1(0.83,75.12) v1(0.93,96.9) v1(0.93,0.82) v1(1.53,73.57) v1(1.68,64.42) v1(1.73,119.42) v1(1.77,34.43) v1(1.73,32.94) v1(1.73,31.51) v1(1.73,30.62) v1(1.73,29.43) v1(1.73,28.54) v1(1.73,27.72) v1(1.73,26.52) v1(1.73,25.32) v1(1.73,23.05) v1(1.73,22.05) v1(1.73,13.42) v1(1.73,11.92) v1(1.73,11.05) v1(1.73,9.87) v1(1.73,8.94) v1(1.73,5.7) v1(1.73,4.72) v1(1.92,20.94) v1(1.92,16.95) v1(1.92,15.77) v1(1.92,14.85) v1(2.13,0.52) v1(2.33,40.52) v1(2.48,119.42) v1(2.69,11.92) v1(2.91,55.23) v1(2.91,39.73) v1(3.13,69.12) v1(3.23,41.02) v1(3.24,0.52) v1(3.37,119.42) v1(3.43,20.92) v1(3.56,12.02) v1(4.18,119.42) v1(4.21,1.57) v1(4.26,0.52) v1(4.52,14.26) v1(4.52,13.25) v1(4.49,12.42) v1(4.63,35.29) v1(4.63,34.42) v1(4.63,33.52) v1(4.63,25.29) v1(4.63,4.29) v1(5.17,119.42) v1(5.2,0.52) v1(6.11,70.62) v1(6.09,0.52) v1(6.33,119.52) v1(7.12,0.52) v1(7.64,119.53) v1(7.85,82.22) v1(7.85,80.82) v1(7.85,79.42) v1(8.15,0.52) v1(8.73,119.62) v1(9.12,0.52) v1(9.25,82.22) v1(9.25,80.82) v1(9.25,79.42) v1(9.69,119.62) v1(10.13,0.52) v1(10.63,119.63) v1(10.65,82.22) v1(10.65,79.42) v1(10.7,64.8) v1(10.95,63.92) v1(11.24,0.51) v1(11.43,119.62) v1(11.38,61.82) v1(11.63,64.7) v1(11.63,64.03) v1(12.03,71.82) v1(12.23,65.02) v1(12.23,64.32) v1(12.23,63.72) v1(12.34,0.52) v1(12.53,119.62) v1(12.51,55.23) v1(12.51,40.63) v1(12.85,70.32) v1(12.78,64.7) v1(12.78,64.07) v1(13.26,0.52) v1(13.43,71.92) v1(13.43,64.12) v1(13.51,50.73) v1(13.66,64.7) v1(13.58,60.57) v1(13.8,119.62) v1(13.93,63.72) v1(14,0.52) v1(14.26,70.72) v1(14.33,65.12) v1(14.33,64.45) v1(14.45,67.32) v1(14.63,63.82) v1(14.91,119.62) v1(15.03,68.82) v1(15.13,70.72) v1(15.13,67.62) v1(15.1,64.7) v1(15.33,0.52) v1(15.54,62.42) v1(16.01,64.71) v1(16.01,62.92) v1(16.09,67.62) v1(16.46,119.62) v1(16.43,70.42) v1(16.45,0.52) v1(16.93,64.02) v1(17.03,114.42) v1(17.13,62.52) v1(17.15,49.02) v1(17.15,47.92) v1(17.43,115.31) v1(17.68,0.52) v1(17.93,119.62) v1(18.03,114.22) v1(18.99,0.52) v1(19.23,114.22) v1(19.55,119.62) v1(19.73,115.32) v1(20.22,114.52) v1(20.2,0.52) v1(20.73,119.62) v1(21.34,89.46) v1(21.43,0.52) v1(21.63,114.32) v1(22.05,119.62) v1(22.03,115.26) v1(22.63,114.42) v1(22.78,0.52) v1(23.39,119.62) v1(23.97,105.56) v1(23.97,104.46) v1(23.93,0.52) v1(24.47,106.06) v1(24.47,104.96) v1(24.56,119.62) v1(24.57,103.86) v1(24.95,105.55) v1(25.07,104.46) v1(25.05,103.3) v1(25.13,0.52) v1(25.52,107.01) v1(25.57,104.96) v1(25.57,103.76) v1(25.75,119.62) v1(25.72,115.52) v1(25.88,102.55) v1(26.02,107.61) v1(26.02,106.51) v1(26.07,104.36) v1(26.38,103.15) v1(26.38,102.05) v1(26.43,118.02) v1(26.43,116.65) v1(26.52,108.11) v1(26.52,107.01) v1(26.53,0.52) v1(26.62,105.91) v1(26.84,119.62) v1(26.88,103.65) v1(26.88,102.55) v1(26.98,101.45) v1(27.03,118.62) v1(27.03,115.22) v1(27,107.6) v1(27.12,106.51) v1(27.1,105.35) v1(27.3,116.43) v1(27.35,103.15) v1(27.42,117.52) v1(27.48,102.05) v1(27.45,100.89) v1(27.63,109.02) v1(27.62,107.01) v1(27.62,105.81) v1(27.76,118.22) v1(27.85,0.52) v1(27.95,118.92) v1(27.93,104.6) v1(27.98,102.55) v1(27.98,101.35) v1(28.13,109.62) v1(28.13,108.52) v1(28.12,106.41) v1(28.33,117.62) v1(28.28,100.15) v1(28.43,105.2) v1(28.43,104.1) v1(28.48,101.95) v1(28.53,119.62) v1(28.53,116.92) v1(28.63,110.12) v1(28.63,109.02) v1(28.73,107.92) v1(28.85,118.06) v1(28.78,100.75) v1(28.78,99.65) v1(28.93,105.7) v1(28.93,104.6) v1(29.03,103.5) v1(29.1,109.62) v1(29.23,108.52) v1(29.2,107.36) v1(29.28,101.25) v1(29.28,100.15) v1(29.32,0.52) v1(29.4,105.2) v1(29.38,99.05) v1(29.53,104.1) v1(29.5,102.94) v1(29.73,109.02) v1(29.73,107.82) v1(29.76,100.74) v1(29.86,98.49) v1(29.88,99.65) v1(29.99,119.62) v1(29.98,106.65) v1(30.03,104.6) v1(30.03,103.4) v1(30.23,108.42) v1(30.33,102.2) v1(30.38,100.15) v1(30.38,98.95) v1(30.48,107.25) v1(30.48,106.15) v1(30.53,104) v1(30.83,102.8) v1(30.83,101.7) v1(30.88,99.55) v1(30.98,107.75) v1(30.98,106.65) v1(31.08,105.55) v1(31.33,103.3) v1(31.33,102.2) v1(31.45,107.25) v1(31.43,101.1) v1(31.55,104.99) v1(31.58,106.15) v1(31.81,102.79) v1(31.93,101.7) v1(31.91,100.54) v1(32.08,106.65) v1(32.08,105.45) v1(32.38,104.25) v1(32.43,102.2) v1(32.43,101) v1(32.58,106.05) v1(32.73,80.32) v1(32.88,104.85) v1(32.88,103.75) v1(32.93,101.6) v1(33.38,105.35) v1(33.38,104.25) v1(33.48,103.15) v1(33.63,79.09) v1(33.86,104.85) v1(33.96,102.59) v1(33.98,103.75) v1(34.48,104.25) v1(34.48,103.05) v1(34.98,103.65) v1(36.03,119.62) v1(36.75,119.62) v1(36.73,0.52) v1(37.53,119.62) v1(37.6,0.52) v1(38.43,119.62) v1(38.55,0.52) v1(39.45,119.62) v1(39.68,0.52) v1(40.72,119.52) v1(40.76,0.52) v1(41.65,119.62) v1(41.67,0.52) v1(42.56,119.62) v1(42.73,0.52) v1(43.33,106.42) v1(43.64,119.62) v1(43.77,0.52) v1(44.33,107.52) v1(44.66,119.62) v1(44.73,0.52) v1(45.03,105.6) v1(45.53,103.22) v1(46.03,107.92) v1(46.11,0.52) v1(46.18,84.47) v1(46.93,104.12) v1(46.93,58.53) v1(47.33,0.52) v1(47.92,119.62) v1(48.03,105.32) v1(48.13,111.62) v1(48.53,0.52) v1(48.73,109.62) v1(49.03,107.72) v1(49.36,119.62) v1(49.45,80.99) v1(49.51,0.52) v1(50.1,58.01) v1(50.54,119.62) v1(50.73,0.52) v1(51.83,0.52) v1(51.88,119.62) v1(52.03,82.42) v1(52.03,81.71) v1(52.03,80.92) v1(52.49,79.13) v1(52.85,86.52) v1(53.11,0.52) v1(54.05,95.12) v1(54.05,88.72) v1(54.03,80.12) v1(54.05,56.62) v1(54.05,50.22) v1(54.19,119.62) v1(54.41,0.52) v1(54.63,79.42) v1(55.16,119.62) v1(55.33,52.12) v1(55.52,0.52) v1(56.2,119.62) v1(56.5,0.52) v1(57.27,119.62) v1(57.51,55.58) v1(57.79,0.52) v1(58.45,70.21) v1(58.93,0.52) v1(59.18,119.62) v1(59.19,65.32) v1(59.19,63.66) v1(59.19,62.32) v1(59.43,69.42) v1(59.43,67.62) v1(59.83,0.89) v1(60.03,119.62) v1(60.03,118.39) v1(60.03,117.68) v1(60.03,116.83) v1(60.03,116) v1(60.03,115.32) v1(60.03,114.69) v1(60.03,113.84) v1(60.03,113.16) v1(60.03,112.44) v1(60.03,111.78) v1(60.03,110.86) v1(60.03,109.82) v1(60.03,109.03) v1(60.03,108.23) v1(60.03,107.44) v1(60.03,106.72) v1(60.03,105.93) v1(60.03,105.24) v1(60.03,104.34) v1(60.03,103.17) v1(60.03,101.97) v1(60.03,100.69) v1(60.03,99.45) v1(60.03,98.24) v1(60.03,97.09) v1(60.03,95.75) v1(60.03,94.52) v1(60.03,93.42) v1(60.03,92.51) v1(60.03,91.39) v1(60.03,90.43) v1(60.03,89.31) v1(60.03,88.32) v1(60.03,87.05) v1(60.03,85.76) v1(60.03,84.56) v1(60.03,83.27) v1(60.03,81.86) v1(60.03,80.57) v1(60.03,79.28) v1(60.03,78.12) v1(60.03,76.74) v1(60.03,75.29) v1(60.03,73.77) v1(60.03,72.22) v1(60.03,71.46) v1(60.03,58.62) v1(60.03,56.73) v1(60.03,55.38) v1(60.03,54.28) v1(60.03,53.12) v1(60.03,51.97) v1(60.03,50.8) v1(60.03,49.6) v1(60.03,48.35) v1(60.03,47.33) v1(60.03,46.13) v1(60.03,44.98) v1(60.03,43.84) v1(60.03,42.68) v1(60.03,41.58) v1(60.03,40.28) v1(60.03,39.14) v1(60.03,38.36) v1(60.03,37.32) v1(60.03,36.26) v1(60.03,35.26) v1(60.03,33.91) v1(60.03,32.02) v1(60.03,30.48) v1(60.03,29.27) v1(60.03,27.71) v1(60.03,26.38) v1(60.03,25.3) v1(60.03,24.18) v1(60,23.12) v1(60,22.01) v1(60,21.13) v1(60,20.38) v1(60,19.63) v1(60.03,18.56) v1(60.03,17.23) v1(60.03,16.15) v1(60.03,15.11) v1(60.03,13.98) v1(60.03,13.08) v1(60.03,11.97) v1(60.03,10.95) v1(60.03,10) v1(60.03,8.75) v1(60.03,7.46) v1(60.03,6.28) v1(60.03,5.19) v1(60.03,4.36) v1(60.03,3.47) v1(60.03,2.61) v1(60.03,1.67) v2(1.78,117.9) v2(1.78,109.37) v2(1.78,107.97) v2(1.78,103.77) v2(1.78,95.5) v2(1.78,94.1) v2(1.78,92.7) v2(1.78,89.9) v2(1.78,63.3) v2(1.78,61.9) v2(1.78,60.5) v2(1.78,59.1) v2(1.78,57.7) v2(1.78,56.3) v2(1.78,53.5) v2(1.78,50.7) v2(1.78,49.3) v2(1.78,47.9) v2(1.78,46.5) v2(1.78,38.1) v2(1.78,36.7) v2(1.78,19.9) v2(1.78,18.5) v2(1.78,7.3) v2(3.18,117.9) v2(3.18,110.77) v2(3.18,109.37) v2(3.18,95.5) v2(3.18,94.1) v2(3.18,92.7) v2(3.18,88.5) v2(3.18,87.1) v2(3.18,85.7) v2(3.18,84.3) v2(3.18,82.9) v2(3.18,81.5) v2(3.18,80.1) v2(3.18,78.7) v2(3.18,77.3) v2(3.18,75.9) v2(3.18,61.9) v2(3.18,60.5) v2(3.18,59.1) v2(3.18,57.7) v2(3.18,56.3) v2(3.18,53.5) v2(3.18,50.7) v2(3.18,49.3) v2(3.18,47.9) v2(3.18,46.5) v2(3.18,38.1) v2(3.18,36.7) v2(3.18,32.5) v2(3.18,31.1) v2(3.18,29.7) v2(3.18,28.3) v2(3.18,26.9) v2(3.18,19.9) v2(3.18,18.5) v2(3.18,17.1) v2(3.18,15.7) v2(3.18,11.5) v2(3.18,10.1) v2(3.18,8.7) v2(4.58,109.37) v2(4.58,94.1) v2(4.58,88.5) v2(4.58,87.1) v2(4.58,85.7) v2(4.58,84.3) v2(4.58,82.9) v2(4.58,81.5) v2(4.58,80.1) v2(4.58,78.7) v2(4.58,77.3) v2(4.58,75.9) v2(4.58,66.1) v2(4.58,61.9) v2(4.58,60.5) v2(4.58,59.1) v2(4.58,57.7) v2(4.58,56.3) v2(4.58,54.9) v2(4.58,53.5) v2(4.58,52.1) v2(4.58,50.7) v2(4.58,49.3) v2(4.58,47.9) v2(4.58,46.5) v2(4.58,42.3) v2(4.58,40.9) v2(4.58,39.5) v2(4.58,38.1) v2(4.58,36.7) v2(4.58,21.3) v2(4.58,19.9) v2(4.58,18.5) v2(4.58,17.1) v2(4.58,15.7) v2(5.98,96.9) v2(5.98,88.5) v2(5.98,87.1) v2(5.98,85.7) v2(5.98,84.3) v2(5.98,82.9) v2(5.98,81.5) v2(5.98,80.1) v2(5.98,78.7) v2(5.98,77.3) v2(5.98,75.9) v2(5.98,61.9) v2(5.98,60.5) v2(5.98,59.1) v2(5.98,57.7) v2(5.98,56.3) v2(5.98,33.9) v2(5.98,32.5) v2(5.98,19.9) v2(5.98,18.5) v2(5.98,17.1) v2(5.98,15.7) v2(5.98,14.3) v2(5.98,12.9) v2(5.98,11.5) v2(5.98,1.7) v2(7.38,115.1) v2(7.38,113.7) v2(7.38,106.7) v2(7.38,105.3) v2(7.38,87.1) v2(7.38,85.7) v2(7.38,84.3) v2(7.38,78.7) v2(7.38,77.3) v2(7.38,75.9) v2(7.38,1.7) v2(8.78,115.1) v2(8.78,113.7) v2(8.78,112.3) v2(8.78,106.7) v2(8.78,105.3) v2(8.78,103.9) v2(8.78,88.5) v2(8.78,85.7) v2(8.78,84.3) v2(8.78,78.7) v2(8.78,77.3) v2(8.78,75.9) v2(8.78,42.3) v2(8.78,40.9) v2(8.78,39.5) v2(8.78,38.1) v2(8.78,25.5) v2(8.78,22.7) v2(8.78,21.3) v2(8.78,19.9) v2(8.78,18.5) v2(8.78,17.1) v2(8.78,15.7) v2(8.78,10.1) v2(8.78,5.9) v2(8.78,4.5) v2(8.78,3.1) v2(8.78,1.7) v2(10.18,115.1) v2(10.18,113.7) v2(10.18,112.3) v2(10.18,105.3) v2(10.18,103.9) v2(10.18,88.5) v2(10.18,87.1) v2(10.18,84.3) v2(10.18,78.7) v2(10.18,77.3) v2(10.18,75.9) v2(10.18,68.9) v2(10.18,54.9) v2(10.18,52.1) v2(10.18,50.7) v2(10.18,47.9) v2(10.18,46.5) v2(10.18,42.3) v2(10.18,40.9) v2(10.18,39.5) v2(10.18,38.1) v2(10.18,36.7) v2(10.18,35.3) v2(10.18,33.9) v2(10.18,32.5) v2(10.18,26.9) v2(10.18,11.5) v2(10.18,10.1) v2(10.18,8.7) v2(10.18,7.3) v2(10.18,5.9) v2(11.58,115.1) v2(11.58,113.7) v2(11.58,110.9) v2(11.58,109.5) v2(11.58,105.3) v2(11.58,88.5) v2(11.58,87.1) v2(11.58,85.7) v2(11.58,82.9) v2(11.58,81.5) v2(11.58,80.1) v2(11.58,78.7) v2(11.58,77.3) v2(11.58,39.5) v2(11.58,38.1) v2(11.58,36.7) v2(11.58,35.3) v2(11.58,33.9) v2(11.58,32.5) v2(11.58,26.9) v2(11.58,25.5) v2(11.58,22.7) v2(11.58,21.3) v2(11.58,19.9) v2(11.58,18.5) v2(11.58,11.5) v2(11.58,10.1) v2(11.58,8.7) v2(11.58,7.3) v2(11.58,5.9) v2(12.98,115.1) v2(12.98,113.7) v2(12.98,110.9) v2(12.98,109.5) v2(12.98,108.1) v2(12.98,88.5) v2(12.98,87.1) v2(12.98,85.7) v2(12.98,82.9) v2(12.98,81.5) v2(12.98,80.1) v2(12.98,78.7) v2(12.98,75.9) v2(12.98,39.5) v2(12.98,38.1) v2(12.98,36.7) v2(12.98,35.3) v2(12.98,33.9) v2(12.98,32.5) v2(12.98,26.9) v2(12.98,25.5) v2(12.98,22.7) v2(12.98,21.3) v2(12.98,19.9) v2(12.98,18.5) v2(12.98,14.3) v2(12.98,12.9) v2(12.98,11.5) v2(12.98,10.1) v2(12.98,8.7) v2(12.98,7.3) v2(12.98,5.9) v2(12.98,1.7) v2(13.41,70.57) v2(14.38,115.1) v2(14.38,113.7) v2(14.38,112.3) v2(14.38,101.1) v2(14.38,88.5) v2(14.38,87.1) v2(14.38,85.7) v2(14.38,82.9) v2(14.38,81.5) v2(14.38,80.1) v2(14.38,77.3) v2(14.38,75.9) v2(14.38,40.9) v2(14.38,39.5) v2(14.38,38.1) v2(14.38,36.7) v2(14.38,35.3) v2(14.38,33.9) v2(14.38,32.5) v2(14.38,26.9) v2(14.38,25.5) v2(14.38,22.7) v2(14.38,21.3) v2(14.38,19.9) v2(14.38,15.7) v2(14.38,14.3) v2(14.38,12.9) v2(14.38,11.5) v2(14.38,10.1) v2(14.38,8.7) v2(14.38,7.3) v2(14.38,5.9) v2(14.38,4.5) v2(14.38,3.1) v2(14.38,1.7) v2(14.53,60.83) v2(15.63,39.32) v2(15.63,38.62) v2(15.63,37.92) v2(15.63,37.22) v2(15.63,36.52) v2(15.63,35.82) v2(15.63,35.12) v2(15.63,34.42) v2(15.63,33.72) v2(15.63,33.02) v2(15.63,32.32) v2(15.63,29.52) v2(15.63,28.82) v2(15.63,28.12) v2(15.63,27.42) v2(15.63,26.72) v2(15.63,26.02) v2(15.63,25.32) v2(15.63,23.22) v2(15.63,22.52) v2(15.63,21.82) v2(15.63,21.12) v2(15.63,20.42) v2(15.63,16.92) v2(15.63,16.22) v2(15.63,15.52) v2(15.63,14.82) v2(15.63,14.12) v2(15.63,13.42) v2(15.63,12.72) v2(15.63,12.02) v2(15.63,11.32) v2(15.63,10.62) v2(15.63,9.92) v2(15.63,9.22) v2(15.63,8.52) v2(15.78,115.1) v2(15.78,113.7) v2(15.78,112.3) v2(15.78,99.7) v2(15.78,56.3) v2(15.78,7.3) v2(15.78,5.9) v2(15.78,4.5) v2(15.78,3.1) v2(15.78,1.7) v2(16.21,69.17) v2(16.33,40.72) v2(16.33,38.62) v2(16.33,37.92) v2(16.33,37.22) v2(16.33,36.52) v2(16.33,35.82) v2(16.33,35.12) v2(16.33,34.42) v2(16.33,33.72) v2(16.33,33.02) v2(16.33,32.32) v2(16.33,29.52) v2(16.33,28.82) v2(16.33,28.12) v2(16.33,27.42) v2(16.33,26.72) v2(16.33,26.02) v2(16.33,25.32) v2(16.33,23.22) v2(16.33,22.52) v2(16.33,21.82) v2(16.33,21.12) v2(16.33,17.62) v2(16.33,16.92) v2(16.33,16.22) v2(16.33,15.52) v2(16.33,14.82) v2(16.33,14.12) v2(16.33,13.42) v2(16.33,12.72) v2(16.33,12.02) v2(16.33,11.32) v2(16.33,10.62) v2(16.33,9.92) v2(16.33,9.22) v2(16.33,8.52) v2(17.03,40.72) v2(17.03,40.02) v2(17.03,37.92) v2(17.03,37.22) v2(17.03,36.52) v2(17.03,35.82) v2(17.03,35.12) v2(17.03,34.42) v2(17.03,33.72) v2(17.03,33.02) v2(17.03,32.32) v2(17.03,29.52) v2(17.03,28.82) v2(17.03,28.12) v2(17.03,27.42) v2(17.03,26.72) v2(17.03,26.02) v2(17.03,25.32) v2(17.03,23.22) v2(17.03,22.52) v2(17.03,21.82) v2(17.03,18.32) v2(17.03,17.62) v2(17.03,16.92) v2(17.03,16.22) v2(17.03,15.52) v2(17.03,14.82) v2(17.03,14.12) v2(17.03,13.42) v2(17.03,12.72) v2(17.03,12.02) v2(17.03,11.32) v2(17.03,10.62) v2(17.03,9.92) v2(17.03,9.22) v2(17.03,8.52) v2(17.18,113.7) v2(17.18,112.3) v2(17.18,105.3) v2(17.18,103.9) v2(17.18,102.5) v2(17.18,57.7) v2(17.18,56.3) v2(17.18,4.5) v2(17.18,3.1) v2(17.18,1.7) v2(17.61,69.17) v2(17.61,67.77) v2(17.61,66.37) v2(17.73,40.72) v2(17.73,40.02) v2(17.73,39.32) v2(17.73,37.22) v2(17.73,36.52) v2(17.73,35.82) v2(17.73,35.12) v2(17.73,34.42) v2(17.73,33.72) v2(17.73,33.02) v2(17.73,32.32) v2(17.73,29.52) v2(17.73,28.82) v2(17.73,28.12) v2(17.73,27.42) v2(17.73,26.72) v2(17.73,26.02) v2(17.73,25.32) v2(17.73,23.22) v2(17.73,22.52) v2(17.73,19.02) v2(17.73,18.32) v2(17.73,17.62) v2(17.73,16.92) v2(17.73,16.22) v2(17.73,15.52) v2(17.73,14.82) v2(17.73,14.12) v2(17.73,13.42) v2(17.73,12.72) v2(17.73,12.02) v2(17.73,11.32) v2(17.73,10.62) v2(17.73,9.92) v2(17.73,9.22) v2(17.73,8.52) v2(18.43,40.02) v2(18.43,39.32) v2(18.43,38.62) v2(18.43,36.52) v2(18.43,35.82) v2(18.43,35.12) v2(18.43,34.42) v2(18.43,33.72) v2(18.43,33.02) v2(18.43,32.32) v2(18.43,29.52) v2(18.43,28.82) v2(18.43,28.12) v2(18.43,27.42) v2(18.43,26.72) v2(18.43,26.02) v2(18.43,25.32) v2(18.43,23.22) v2(18.43,19.72) v2(18.43,19.02) v2(18.43,18.32) v2(18.43,17.62) v2(18.43,16.92) v2(18.43,16.22) v2(18.43,15.52) v2(18.43,14.82) v2(18.43,14.12) v2(18.43,13.42) v2(18.43,12.72) v2(18.43,12.02) v2(18.43,11.32) v2(18.43,10.62) v2(18.43,9.92) v2(18.43,9.22) v2(18.43,8.52) v2(18.58,115.1) v2(18.58,113.7) v2(18.58,112.3) v2(18.58,106.7) v2(18.58,105.3) v2(18.58,103.9) v2(18.58,4.5) v2(18.58,3.1) v2(18.58,1.7) v2(19.13,39.32) v2(19.13,38.62) v2(19.13,37.92) v2(19.13,35.82) v2(19.13,35.12) v2(19.13,34.42) v2(19.13,33.72) v2(19.13,33.02) v2(19.13,32.32) v2(19.13,29.52) v2(19.13,28.82) v2(19.13,28.12) v2(19.13,27.42) v2(19.13,26.72) v2(19.13,26.02) v2(19.13,25.32) v2(19.13,20.42) v2(19.13,19.72) v2(19.13,19.02) v2(19.13,18.32) v2(19.13,17.62) v2(19.13,16.92) v2(19.13,16.22) v2(19.13,15.52) v2(19.13,14.82) v2(19.13,14.12) v2(19.13,13.42) v2(19.13,12.72) v2(19.13,12.02) v2(19.13,11.32) v2(19.13,10.62) v2(19.13,9.92) v2(19.13,9.22) v2(19.13,8.52) v2(19.83,38.62) v2(19.83,37.92) v2(19.83,37.22) v2(19.83,35.12) v2(19.83,34.42) v2(19.83,33.72) v2(19.83,33.02) v2(19.83,32.32) v2(19.83,29.52) v2(19.83,28.82) v2(19.83,28.12) v2(19.83,27.42) v2(19.83,26.72) v2(19.83,26.02) v2(19.83,25.32) v2(19.83,21.12) v2(19.83,20.42) v2(19.83,19.72) v2(19.83,19.02) v2(19.83,18.32) v2(19.83,17.62) v2(19.83,16.92) v2(19.83,16.22) v2(19.83,15.52) v2(19.83,14.82) v2(19.83,14.12) v2(19.83,13.42) v2(19.83,12.72) v2(19.83,12.02) v2(19.83,11.32) v2(19.83,10.62) v2(19.83,9.92) v2(19.83,9.22) v2(19.83,8.52) v2(19.98,113.7) v2(19.98,112.3) v2(19.98,105.3) v2(19.98,4.5) v2(19.98,3.1) v2(19.98,1.7) v2(20.53,37.92) v2(20.53,37.22) v2(20.53,36.52) v2(20.53,34.42) v2(20.53,33.72) v2(20.53,33.02) v2(20.53,32.32) v2(20.53,29.52) v2(20.53,28.82) v2(20.53,28.12) v2(20.53,27.42) v2(20.53,26.72) v2(20.53,26.02) v2(20.53,25.32) v2(20.53,21.82) v2(20.53,21.12) v2(20.53,20.42) v2(20.53,19.72) v2(20.53,19.02) v2(20.53,18.32) v2(20.53,17.62) v2(20.53,16.92) v2(20.53,16.22) v2(20.53,15.52) v2(20.53,14.82) v2(20.53,14.12) v2(20.53,13.42) v2(20.53,12.72) v2(20.53,12.02) v2(20.53,11.32) v2(20.53,10.62) v2(20.53,9.92) v2(20.53,9.22) v2(20.53,8.52) v2(21.23,37.22) v2(21.23,36.52) v2(21.23,35.82) v2(21.23,33.72) v2(21.23,33.02) v2(21.23,32.32) v2(21.23,29.52) v2(21.23,28.82) v2(21.23,28.12) v2(21.23,27.42) v2(21.23,26.72) v2(21.23,26.02) v2(21.23,22.52) v2(21.23,21.82) v2(21.23,21.12) v2(21.23,20.42) v2(21.23,19.72) v2(21.23,19.02) v2(21.23,18.32) v2(21.23,17.62) v2(21.23,16.92) v2(21.23,16.22) v2(21.23,15.52) v2(21.23,14.82) v2(21.23,14.12) v2(21.23,13.42) v2(21.23,12.72) v2(21.23,12.02) v2(21.23,11.32) v2(21.23,10.62) v2(21.23,9.92) v2(21.23,9.22) v2(21.23,8.52) v2(21.38,113.7) v2(21.38,112.3) v2(21.38,110.9) v2(21.38,92.7) v2(21.38,87.1) v2(21.38,71.7) v2(21.38,63.3) v2(21.38,61.9) v2(21.38,56.3) v2(21.38,54.9) v2(21.38,50.7) v2(21.38,42.3) v2(21.38,4.5) v2(21.38,3.1) v2(21.38,1.7) v2(21.93,40.72) v2(21.93,36.52) v2(21.93,35.82) v2(21.93,35.12) v2(21.93,33.02) v2(21.93,32.32) v2(21.93,29.52) v2(21.93,28.82) v2(21.93,28.12) v2(21.93,27.42) v2(21.93,26.72) v2(21.93,23.22) v2(21.93,22.52) v2(21.93,21.82) v2(21.93,21.12) v2(21.93,20.42) v2(21.93,19.72) v2(21.93,19.02) v2(21.93,18.32) v2(21.93,17.62) v2(21.93,16.92) v2(21.93,16.22) v2(21.93,15.52) v2(21.93,14.82) v2(21.93,14.12) v2(21.93,13.42) v2(21.93,12.72) v2(21.93,12.02) v2(21.93,11.32) v2(21.93,10.62) v2(21.93,9.92) v2(21.93,9.22) v2(21.93,8.52) v2(22.63,40.72) v2(22.63,40.02) v2(22.63,35.82) v2(22.63,35.12) v2(22.63,34.42) v2(22.63,32.32) v2(22.63,29.52) v2(22.63,28.82) v2(22.63,28.12) v2(22.63,27.42) v2(22.63,23.92) v2(22.63,23.22) v2(22.63,22.52) v2(22.63,21.82) v2(22.63,21.12) v2(22.63,20.42) v2(22.63,19.72) v2(22.63,19.02) v2(22.63,18.32) v2(22.63,17.62) v2(22.63,16.92) v2(22.63,16.22) v2(22.63,15.52) v2(22.63,14.82) v2(22.63,14.12) v2(22.63,13.42) v2(22.63,12.72) v2(22.63,12.02) v2(22.63,11.32) v2(22.63,10.62) v2(22.63,9.92) v2(22.63,9.22) v2(22.63,8.52) v2(22.78,113.7) v2(22.78,112.3) v2(22.78,95.5) v2(22.78,94.1) v2(22.78,87.1) v2(22.78,85.7) v2(22.78,84.3) v2(22.78,73.1) v2(22.78,71.7) v2(22.78,67.5) v2(22.78,63.3) v2(22.78,61.9) v2(22.78,56.3) v2(22.78,54.9) v2(22.78,53.5) v2(22.78,49.3) v2(22.78,42.3) v2(22.78,7.3) v2(22.78,5.9) v2(22.78,4.5) v2(22.78,3.1) v2(22.78,1.7) v2(23.33,40.72) v2(23.33,40.02) v2(23.33,39.32) v2(23.33,35.12) v2(23.33,34.42) v2(23.33,33.72) v2(23.33,29.52) v2(23.33,28.82) v2(23.33,28.12) v2(23.33,24.62) v2(23.33,23.92) v2(23.33,23.22) v2(23.33,22.52) v2(23.33,21.82) v2(23.33,21.12) v2(23.33,20.42) v2(23.33,19.72) v2(23.33,19.02) v2(23.33,18.32) v2(23.33,17.62) v2(23.33,16.92) v2(23.33,16.22) v2(23.33,15.52) v2(23.33,14.82) v2(23.33,14.12) v2(23.33,13.42) v2(23.33,12.72) v2(23.33,12.02) v2(23.33,11.32) v2(23.33,10.62) v2(23.33,9.92) v2(23.33,9.22) v2(23.33,8.52) v2(24.03,40.72) v2(24.03,40.02) v2(24.03,39.32) v2(24.03,38.62) v2(24.03,33.72) v2(24.03,33.02) v2(24.03,29.52) v2(24.03,28.82) v2(24.03,25.32) v2(24.03,24.62) v2(24.03,23.92) v2(24.03,23.22) v2(24.03,22.52) v2(24.03,21.82) v2(24.03,21.12) v2(24.03,20.42) v2(24.03,19.72) v2(24.03,19.02) v2(24.03,18.32) v2(24.03,17.62) v2(24.03,14.12) v2(24.03,13.42) v2(24.03,12.72) v2(24.03,12.02) v2(24.03,11.32) v2(24.03,10.62) v2(24.03,9.92) v2(24.03,9.22) v2(24.03,8.52) v2(24.18,106.7) v2(24.18,92.7) v2(24.18,88.5) v2(24.18,87.1) v2(24.18,85.7) v2(24.18,84.3) v2(24.18,73.1) v2(24.18,71.7) v2(24.18,70.3) v2(24.18,68.9) v2(24.18,56.3) v2(24.18,54.9) v2(24.18,53.5) v2(24.18,52.1) v2(24.18,42.3) v2(24.18,7.3) v2(24.18,5.9) v2(24.18,4.5) v2(24.18,3.1) v2(24.18,1.7) v2(24.73,40.72) v2(24.73,40.02) v2(24.73,39.32) v2(24.73,38.62) v2(24.73,37.92) v2(24.73,29.52) v2(24.73,26.02) v2(24.73,25.32) v2(24.73,24.62) v2(24.73,23.92) v2(24.73,23.22) v2(24.73,22.52) v2(24.73,21.82) v2(24.73,21.12) v2(24.73,20.42) v2(24.73,19.72) v2(24.73,19.02) v2(24.73,18.32) v2(24.73,14.12) v2(24.73,13.42) v2(24.73,12.72) v2(24.73,12.02) v2(24.73,11.32) v2(24.73,10.62) v2(24.73,9.92) v2(24.73,9.22) v2(24.73,8.52) v2(25.43,40.72) v2(25.43,40.02) v2(25.43,39.32) v2(25.43,38.62) v2(25.43,37.92) v2(25.43,26.72) v2(25.43,26.02) v2(25.43,25.32) v2(25.43,24.62) v2(25.43,23.92) v2(25.43,23.22) v2(25.43,22.52) v2(25.43,21.82) v2(25.43,21.12) v2(25.43,20.42) v2(25.43,19.72) v2(25.43,19.02) v2(25.43,18.32) v2(25.43,14.12) v2(25.43,13.42) v2(25.43,12.72) v2(25.43,12.02) v2(25.43,11.32) v2(25.43,10.62) v2(25.43,9.92) v2(25.43,9.22) v2(25.43,8.52) v2(25.58,94.1) v2(25.58,92.7) v2(25.58,91.3) v2(25.58,88.5) v2(25.58,87.1) v2(25.58,85.7) v2(25.58,84.3) v2(25.58,80.1) v2(25.58,78.7) v2(25.58,71.7) v2(25.58,70.3) v2(25.58,68.9) v2(25.58,56.3) v2(25.58,54.9) v2(25.58,53.5) v2(25.58,52.1) v2(25.58,50.7) v2(25.58,42.3) v2(25.58,7.3) v2(25.58,5.9) v2(25.58,4.5) v2(25.58,3.1) v2(25.58,1.7) v2(26.13,40.72) v2(26.13,40.02) v2(26.13,39.32) v2(26.13,38.62) v2(26.13,37.92) v2(26.13,27.42) v2(26.13,26.72) v2(26.13,26.02) v2(26.13,25.32) v2(26.13,24.62) v2(26.13,23.92) v2(26.13,23.22) v2(26.13,22.52) v2(26.13,21.82) v2(26.13,21.12) v2(26.13,20.42) v2(26.13,19.72) v2(26.13,19.02) v2(26.13,18.32) v2(26.13,17.62) v2(26.13,16.92) v2(26.13,16.22) v2(26.13,15.52) v2(26.13,14.82) v2(26.13,14.12) v2(26.13,13.42) v2(26.13,12.72) v2(26.13,12.02) v2(26.13,11.32) v2(26.13,10.62) v2(26.13,9.92) v2(26.13,9.22) v2(26.13,8.52) v2(26.83,40.72) v2(26.83,40.02) v2(26.83,39.32) v2(26.83,38.62) v2(26.83,37.92) v2(26.83,28.12) v2(26.83,27.42) v2(26.83,26.72) v2(26.83,26.02) v2(26.83,25.32) v2(26.83,24.62) v2(26.83,23.92) v2(26.83,23.22) v2(26.83,22.52) v2(26.83,21.82) v2(26.83,21.12) v2(26.83,20.42) v2(26.83,19.72) v2(26.83,19.02) v2(26.83,18.32) v2(26.83,14.12) v2(26.83,13.42) v2(26.83,12.72) v2(26.83,12.02) v2(26.83,11.32) v2(26.83,10.62) v2(26.83,9.92) v2(26.83,9.22) v2(26.83,8.52) v2(26.98,112.3) v2(26.98,109.5) v2(26.98,92.7) v2(26.98,91.3) v2(26.98,88.5) v2(26.98,87.1) v2(26.98,85.7) v2(26.98,84.3) v2(26.98,80.1) v2(26.98,78.7) v2(26.98,70.3) v2(26.98,68.9) v2(26.98,56.3) v2(26.98,54.9) v2(26.98,53.5) v2(26.98,52.1) v2(26.98,50.7) v2(26.98,49.3) v2(26.98,7.3) v2(26.98,5.9) v2(26.98,4.5) v2(26.98,3.1) v2(26.98,1.7) v2(27.53,40.72) v2(27.53,40.02) v2(27.53,39.32) v2(27.53,38.62) v2(27.53,37.92) v2(27.53,35.12) v2(27.53,28.12) v2(27.53,27.42) v2(27.53,26.72) v2(27.53,26.02) v2(27.53,25.32) v2(27.53,24.62) v2(27.53,23.92) v2(27.53,23.22) v2(27.53,22.52) v2(27.53,21.82) v2(27.53,21.12) v2(27.53,20.42) v2(27.53,19.72) v2(27.53,19.02) v2(27.53,18.32) v2(27.53,14.12) v2(27.53,13.42) v2(27.53,12.72) v2(27.53,12.02) v2(27.53,11.32) v2(27.53,10.62) v2(27.53,9.92) v2(27.53,9.22) v2(27.53,8.52) v2(28.23,40.02) v2(28.23,39.32) v2(28.23,38.62) v2(28.23,37.92) v2(28.23,35.12) v2(28.23,34.42) v2(28.23,28.12) v2(28.23,27.42) v2(28.23,26.72) v2(28.23,26.02) v2(28.23,25.32) v2(28.23,24.62) v2(28.23,23.92) v2(28.23,23.22) v2(28.23,22.52) v2(28.23,21.82) v2(28.23,21.12) v2(28.23,20.42) v2(28.23,19.72) v2(28.23,19.02) v2(28.23,18.32) v2(28.23,17.62) v2(28.23,14.12) v2(28.23,13.42) v2(28.23,12.72) v2(28.23,12.02) v2(28.23,11.32) v2(28.23,10.62) v2(28.23,9.92) v2(28.23,9.22) v2(28.23,8.52) v2(28.38,115.1) v2(28.38,113.7) v2(28.38,112.3) v2(28.38,110.9) v2(28.38,92.7) v2(28.38,91.3) v2(28.38,88.5) v2(28.38,84.3) v2(28.38,80.1) v2(28.38,78.7) v2(28.38,75.9) v2(28.38,56.3) v2(28.38,54.9) v2(28.38,53.5) v2(28.38,52.1) v2(28.38,50.7) v2(28.38,49.3) v2(28.38,43.7) v2(28.38,7.3) v2(28.38,5.9) v2(28.38,4.5) v2(28.38,3.1) v2(28.38,1.7) v2(28.93,39.32) v2(28.93,38.62) v2(28.93,37.92) v2(28.93,35.12) v2(28.93,34.42) v2(28.93,28.12) v2(28.93,27.42) v2(28.93,26.72) v2(28.93,26.02) v2(28.93,25.32) v2(28.93,22.52) v2(28.93,21.82) v2(28.93,21.12) v2(28.93,20.42) v2(28.93,19.72) v2(28.93,19.02) v2(28.93,18.32) v2(28.93,17.62) v2(28.93,14.82) v2(28.93,14.12) v2(28.93,13.42) v2(28.93,12.72) v2(28.93,12.02) v2(28.93,11.32) v2(28.93,10.62) v2(28.93,9.92) v2(28.93,9.22) v2(28.93,8.52) v2(29.63,38.62) v2(29.63,37.92) v2(29.63,28.12) v2(29.63,27.42) v2(29.63,26.72) v2(29.63,26.02) v2(29.63,21.82) v2(29.63,21.12) v2(29.63,20.42) v2(29.63,19.72) v2(29.63,19.02) v2(29.63,18.32) v2(29.63,14.12) v2(29.63,13.42) v2(29.63,12.72) v2(29.63,12.02) v2(29.63,11.32) v2(29.63,10.62) v2(29.63,9.92) v2(29.63,9.22) v2(29.63,8.52) v2(29.78,117.9) v2(29.78,116.5) v2(29.78,115.1) v2(29.78,112.3) v2(29.78,110.9) v2(29.78,95.5) v2(29.78,94.1) v2(29.78,92.7) v2(29.78,91.3) v2(29.78,88.5) v2(29.78,84.3) v2(29.78,80.1) v2(29.78,78.7) v2(29.78,75.9) v2(29.78,74.5) v2(29.78,56.3) v2(29.78,54.9) v2(29.78,53.5) v2(29.78,52.1) v2(29.78,50.7) v2(29.78,49.3) v2(29.78,45.1) v2(29.78,43.7) v2(29.78,42.3) v2(29.78,7.3) v2(29.78,5.9) v2(29.78,4.5) v2(29.78,3.1) v2(30.33,40.72) v2(30.33,37.92) v2(30.33,28.12) v2(30.33,27.42) v2(30.33,26.72) v2(30.33,21.12) v2(30.33,20.42) v2(30.33,19.72) v2(30.33,19.02) v2(30.33,18.32) v2(30.33,14.12) v2(30.33,13.42) v2(30.33,12.72) v2(30.33,12.02) v2(30.33,11.32) v2(30.33,10.62) v2(30.33,9.92) v2(30.33,9.22) v2(30.33,8.52) v2(31.03,40.72) v2(31.03,40.02) v2(31.03,37.22) v2(31.03,28.12) v2(31.03,27.42) v2(31.03,21.12) v2(31.03,20.42) v2(31.03,19.72) v2(31.03,19.02) v2(31.03,18.32) v2(31.03,17.62) v2(31.03,14.82) v2(31.03,14.12) v2(31.03,13.42) v2(31.03,12.72) v2(31.03,12.02) v2(31.03,11.32) v2(31.03,10.62) v2(31.03,9.92) v2(31.03,9.22) v2(31.03,8.52) v2(31.18,119.3) v2(31.18,117.9) v2(31.18,110.9) v2(31.18,109.5) v2(31.18,95.5) v2(31.18,94.1) v2(31.18,92.7) v2(31.18,91.3) v2(31.18,88.5) v2(31.18,84.3) v2(31.18,80.1) v2(31.18,75.9) v2(31.18,56.3) v2(31.18,54.9) v2(31.18,53.5) v2(31.18,52.1) v2(31.18,50.7) v2(31.18,46.5) v2(31.18,45.1) v2(31.18,43.7) v2(31.18,42.3) v2(31.18,7.3) v2(31.18,5.9) v2(31.18,4.5) v2(31.18,3.1) v2(31.28,69.69) v2(31.73,40.72) v2(31.73,40.02) v2(31.73,39.32) v2(31.73,36.52) v2(31.73,28.12) v2(31.73,27.42) v2(31.73,20.42) v2(31.73,19.72) v2(31.73,19.02) v2(31.73,18.32) v2(31.73,17.62) v2(31.73,14.12) v2(31.73,13.42) v2(31.73,12.72) v2(31.73,12.02) v2(31.73,11.32) v2(31.73,10.62) v2(31.73,9.92) v2(31.73,9.22) v2(31.73,8.52) v2(32.43,40.72) v2(32.43,40.02) v2(32.43,39.32) v2(32.43,38.62) v2(32.43,35.82) v2(32.43,35.12) v2(32.43,34.42) v2(32.43,33.02) v2(32.43,28.12) v2(32.43,27.42) v2(32.43,21.12) v2(32.43,20.42) v2(32.43,19.72) v2(32.43,19.02) v2(32.43,18.32) v2(32.43,14.12) v2(32.43,13.42) v2(32.43,12.72) v2(32.43,12.02) v2(32.43,11.32) v2(32.43,10.62) v2(32.43,9.92) v2(32.43,9.22) v2(32.43,8.52) v2(32.58,92.7) v2(32.58,91.3) v2(32.58,88.5) v2(32.58,87.1) v2(32.58,85.7) v2(32.58,84.3) v2(32.58,56.3) v2(32.58,54.9) v2(32.58,53.5) v2(32.58,52.1) v2(32.58,46.5) v2(32.58,45.1) v2(32.58,43.7) v2(32.58,42.3) v2(32.58,7.3) v2(32.58,5.9) v2(32.58,4.5) v2(32.58,3.1) v2(32.68,69.69) v2(33.13,40.72) v2(33.13,40.02) v2(33.13,39.32) v2(33.13,38.62) v2(33.13,37.92) v2(33.13,35.12) v2(33.13,34.42) v2(33.13,33.72) v2(33.13,33.02) v2(33.13,28.12) v2(33.13,27.42) v2(33.13,26.72) v2(33.13,21.12) v2(33.13,20.42) v2(33.13,19.72) v2(33.13,19.02) v2(33.13,18.32) v2(33.13,14.12) v2(33.13,13.42) v2(33.13,12.72) v2(33.13,12.02) v2(33.13,11.32) v2(33.13,10.62) v2(33.13,9.92) v2(33.13,9.22) v2(33.13,8.52) v2(33.83,40.72) v2(33.83,40.02) v2(33.83,39.32) v2(33.83,38.62) v2(33.83,37.92) v2(33.83,37.22) v2(33.83,34.42) v2(33.83,33.72) v2(33.83,33.02) v2(33.83,32.32) v2(33.83,28.12) v2(33.83,27.42) v2(33.83,26.72) v2(33.83,26.02) v2(33.83,21.82) v2(33.83,21.12) v2(33.83,20.42) v2(33.83,19.72) v2(33.83,19.02) v2(33.83,18.32) v2(33.83,17.62) v2(33.83,16.92) v2(33.83,16.22) v2(33.83,15.52) v2(33.83,14.82) v2(33.83,14.12) v2(33.83,13.42) v2(33.83,12.72) v2(33.83,12.02) v2(33.83,11.32) v2(33.83,10.62) v2(33.83,9.92) v2(33.83,9.22) v2(33.83,8.52) v2(33.98,112.3) v2(33.98,94.1) v2(33.98,92.7) v2(33.98,89.9) v2(33.98,88.5) v2(33.98,87.1) v2(33.98,85.7) v2(33.98,84.3) v2(33.98,56.3) v2(33.98,54.9) v2(33.98,53.5) v2(33.98,49.3) v2(33.98,46.5) v2(33.98,45.1) v2(33.98,43.7) v2(33.98,42.3) v2(33.98,7.3) v2(33.98,5.9) v2(33.98,4.5) v2(33.98,3.1) v2(34.08,69.69) v2(34.53,40.72) v2(34.53,40.02) v2(34.53,39.32) v2(34.53,38.62) v2(34.53,37.92) v2(34.53,37.22) v2(34.53,36.52) v2(34.53,33.72) v2(34.53,28.12) v2(34.53,27.42) v2(34.53,26.72) v2(34.53,26.02) v2(34.53,25.32) v2(34.53,22.52) v2(34.53,21.82) v2(34.53,21.12) v2(34.53,20.42) v2(34.53,19.72) v2(34.53,19.02) v2(34.53,18.32) v2(34.53,14.12) v2(34.53,13.42) v2(34.53,12.72) v2(34.53,12.02) v2(34.53,11.32) v2(34.53,10.62) v2(34.53,9.92) v2(34.53,9.22) v2(34.53,8.52) v2(35.23,40.72) v2(35.23,40.02) v2(35.23,39.32) v2(35.23,38.62) v2(35.23,37.92) v2(35.23,37.22) v2(35.23,36.52) v2(35.23,35.82) v2(35.23,28.12) v2(35.23,27.42) v2(35.23,26.72) v2(35.23,26.02) v2(35.23,25.32) v2(35.23,24.62) v2(35.23,23.92) v2(35.23,23.22) v2(35.23,22.52) v2(35.23,21.82) v2(35.23,21.12) v2(35.23,20.42) v2(35.23,19.72) v2(35.23,19.02) v2(35.23,18.32) v2(35.23,14.12) v2(35.23,13.42) v2(35.23,12.72) v2(35.23,12.02) v2(35.23,11.32) v2(35.23,10.62) v2(35.23,9.92) v2(35.23,9.22) v2(35.23,8.52) v2(35.38,116.5) v2(35.38,115.1) v2(35.38,113.7) v2(35.38,112.3) v2(35.38,94.1) v2(35.38,91.3) v2(35.38,89.9) v2(35.38,88.5) v2(35.38,87.1) v2(35.38,85.7) v2(35.38,84.3) v2(35.38,77.3) v2(35.38,59.1) v2(35.38,56.3) v2(35.38,54.9) v2(35.38,50.7) v2(35.38,49.3) v2(35.38,46.5) v2(35.38,45.1) v2(35.38,43.7) v2(35.38,42.3) v2(35.38,7.3) v2(35.38,5.9) v2(35.38,4.5) v2(35.38,3.1) v2(35.93,40.72) v2(35.93,40.02) v2(35.93,39.32) v2(35.93,38.62) v2(35.93,37.92) v2(35.93,37.22) v2(35.93,36.52) v2(35.93,35.82) v2(35.93,35.12) v2(35.93,28.82) v2(35.93,28.12) v2(35.93,27.42) v2(35.93,26.72) v2(35.93,26.02) v2(35.93,25.32) v2(35.93,24.62) v2(35.93,23.92) v2(35.93,23.22) v2(35.93,22.52) v2(35.93,21.82) v2(35.93,21.12) v2(35.93,20.42) v2(35.93,19.72) v2(35.93,19.02) v2(35.93,18.32) v2(35.93,17.62) v2(35.93,14.12) v2(35.93,13.42) v2(35.93,12.72) v2(35.93,12.02) v2(35.93,11.32) v2(35.93,10.62) v2(35.93,9.92) v2(35.93,9.22) v2(35.93,8.52) v2(36.63,40.72) v2(36.63,40.02) v2(36.63,39.32) v2(36.63,38.62) v2(36.63,37.92) v2(36.63,37.22) v2(36.63,36.52) v2(36.63,35.82) v2(36.63,35.12) v2(36.63,34.42) v2(36.63,28.82) v2(36.63,28.12) v2(36.63,27.42) v2(36.63,26.72) v2(36.63,26.02) v2(36.63,25.32) v2(36.63,24.62) v2(36.63,23.92) v2(36.63,23.22) v2(36.63,22.52) v2(36.63,21.82) v2(36.63,21.12) v2(36.63,20.42) v2(36.63,19.72) v2(36.63,19.02) v2(36.63,18.32) v2(36.63,17.62) v2(36.63,16.92) v2(36.63,16.22) v2(36.63,15.52) v2(36.63,14.82) v2(36.63,14.12) v2(36.63,13.42) v2(36.63,12.72) v2(36.63,12.02) v2(36.63,11.32) v2(36.63,10.62) v2(36.63,9.92) v2(36.63,9.22) v2(36.63,8.52) v2(36.78,117.9) v2(36.78,116.5) v2(36.78,115.1) v2(36.78,113.7) v2(36.78,112.3) v2(36.78,110.9) v2(36.78,92.7) v2(36.78,91.3) v2(36.78,89.9) v2(36.78,88.5) v2(36.78,87.1) v2(36.78,85.7) v2(36.78,84.3) v2(36.78,74.5) v2(36.78,60.5) v2(36.78,59.1) v2(36.78,50.7) v2(36.78,49.3) v2(36.78,46.5) v2(36.78,45.1) v2(36.78,43.7) v2(36.78,42.3) v2(36.78,7.3) v2(36.78,5.9) v2(36.78,4.5) v2(36.78,3.1) v2(37.33,40.02) v2(37.33,39.32) v2(37.33,38.62) v2(37.33,37.92) v2(37.33,37.22) v2(37.33,36.52) v2(37.33,35.82) v2(37.33,35.12) v2(37.33,29.52) v2(37.33,28.82) v2(37.33,28.12) v2(37.33,27.42) v2(37.33,26.72) v2(37.33,26.02) v2(37.33,25.32) v2(37.33,24.62) v2(37.33,23.92) v2(37.33,23.22) v2(37.33,22.52) v2(37.33,21.82) v2(37.33,21.12) v2(37.33,20.42) v2(37.33,19.72) v2(37.33,19.02) v2(37.33,18.32) v2(37.33,17.62) v2(37.33,14.12) v2(37.33,13.42) v2(37.33,12.72) v2(37.33,12.02) v2(37.33,11.32) v2(37.33,10.62) v2(37.33,9.92) v2(37.33,9.22) v2(37.33,8.52) v2(38.03,29.52) v2(38.03,28.82) v2(38.03,28.12) v2(38.03,27.42) v2(38.03,26.72) v2(38.03,26.02) v2(38.03,25.32) v2(38.03,24.62) v2(38.03,23.92) v2(38.03,23.22) v2(38.03,22.52) v2(38.03,21.82) v2(38.03,21.12) v2(38.03,20.42) v2(38.03,19.72) v2(38.03,19.02) v2(38.03,18.32) v2(38.03,17.62) v2(38.03,14.12) v2(38.03,13.42) v2(38.03,12.72) v2(38.03,12.02) v2(38.03,11.32) v2(38.03,10.62) v2(38.03,9.92) v2(38.03,9.22) v2(38.03,8.52) v2(38.18,117.9) v2(38.18,116.5) v2(38.18,115.1) v2(38.18,113.7) v2(38.18,112.3) v2(38.18,110.9) v2(38.18,109.5) v2(38.18,103.9) v2(38.18,102.5) v2(38.18,94.1) v2(38.18,92.7) v2(38.18,91.3) v2(38.18,89.9) v2(38.18,88.5) v2(38.18,87.1) v2(38.18,85.7) v2(38.18,84.3) v2(38.18,7.3) v2(38.18,5.9) v2(38.18,4.5) v2(38.18,3.1) v2(38.18,1.7) v2(38.73,30.92) v2(38.73,30.22) v2(38.73,29.52) v2(38.73,28.82) v2(38.73,28.12) v2(38.73,27.42) v2(38.73,26.72) v2(38.73,26.02) v2(38.73,25.32) v2(38.73,24.62) v2(38.73,23.92) v2(38.73,23.22) v2(38.73,22.52) v2(38.73,21.82) v2(38.73,21.12) v2(38.73,20.42) v2(38.73,19.72) v2(38.73,19.02) v2(38.73,18.32) v2(38.73,17.62) v2(38.73,14.12) v2(38.73,13.42) v2(38.73,12.72) v2(38.73,12.02) v2(38.73,11.32) v2(38.73,10.62) v2(38.73,9.92) v2(38.73,9.22) v2(38.73,8.52) v2(39.43,31.62) v2(39.43,30.92) v2(39.43,30.22) v2(39.43,29.52) v2(39.43,28.82) v2(39.43,28.12) v2(39.43,27.42) v2(39.43,26.72) v2(39.43,26.02) v2(39.43,25.32) v2(39.43,24.62) v2(39.43,23.92) v2(39.43,23.22) v2(39.43,22.52) v2(39.43,21.82) v2(39.43,21.12) v2(39.43,20.42) v2(39.43,19.72) v2(39.43,19.02) v2(39.43,18.32) v2(39.43,17.62) v2(39.43,14.12) v2(39.43,13.42) v2(39.43,12.72) v2(39.43,12.02) v2(39.43,11.32) v2(39.43,10.62) v2(39.43,9.92) v2(39.43,9.22) v2(39.43,8.52) v2(39.58,117.9) v2(39.58,116.5) v2(39.58,115.1) v2(39.58,113.7) v2(39.58,112.3) v2(39.58,110.9) v2(39.58,109.5) v2(39.58,108.1) v2(39.58,103.9) v2(39.58,102.5) v2(39.58,101.1) v2(39.58,94.1) v2(39.58,92.7) v2(39.58,91.3) v2(39.58,89.9) v2(39.58,88.5) v2(39.58,87.1) v2(39.58,85.7) v2(39.58,84.3) v2(39.58,7.3) v2(39.58,5.9) v2(39.58,4.5) v2(39.58,3.1) v2(39.58,1.7) v2(40.13,32.32) v2(40.13,31.62) v2(40.13,30.92) v2(40.13,30.22) v2(40.13,29.52) v2(40.13,28.82) v2(40.13,28.12) v2(40.13,27.42) v2(40.13,26.72) v2(40.13,26.02) v2(40.13,25.32) v2(40.13,24.62) v2(40.13,23.92) v2(40.13,23.22) v2(40.13,22.52) v2(40.13,21.82) v2(40.13,21.12) v2(40.13,20.42) v2(40.13,19.72) v2(40.13,19.02) v2(40.13,18.32) v2(40.13,17.62) v2(40.13,16.92) v2(40.13,16.22) v2(40.13,15.52) v2(40.13,14.82) v2(40.13,14.12) v2(40.13,13.42) v2(40.13,12.72) v2(40.13,12.02) v2(40.13,11.32) v2(40.13,10.62) v2(40.13,9.92) v2(40.13,9.22) v2(40.13,8.52) v2(40.83,40.72) v2(40.83,40.02) v2(40.83,39.32) v2(40.83,38.62) v2(40.83,37.92) v2(40.83,37.22) v2(40.83,36.52) v2(40.83,35.82) v2(40.83,35.12) v2(40.83,34.42) v2(40.83,33.72) v2(40.83,33.02) v2(40.83,32.32) v2(40.83,31.62) v2(40.83,30.92) v2(40.83,30.22) v2(40.83,29.52) v2(40.83,28.82) v2(40.83,28.12) v2(40.83,27.42) v2(40.83,26.72) v2(40.83,26.02) v2(40.83,25.32) v2(40.83,24.62) v2(40.83,23.92) v2(40.83,23.22) v2(40.83,22.52) v2(40.83,21.82) v2(40.83,21.12) v2(40.83,20.42) v2(40.83,19.72) v2(40.83,19.02) v2(40.83,18.32) v2(40.83,17.62) v2(40.83,16.92) v2(40.83,16.22) v2(40.83,15.52) v2(40.83,14.82) v2(40.83,14.12) v2(40.83,13.42) v2(40.83,12.72) v2(40.83,12.02) v2(40.83,11.32) v2(40.83,10.62) v2(40.83,9.92) v2(40.83,9.22) v2(40.83,8.52) v2(40.98,117.9) v2(40.98,116.5) v2(40.98,115.1) v2(40.98,113.7) v2(40.98,112.3) v2(40.98,110.9) v2(40.98,109.5) v2(40.98,108.1) v2(40.98,106.7) v2(40.98,105.3) v2(40.98,103.9) v2(40.98,95.5) v2(40.98,94.1) v2(40.98,92.7) v2(40.98,91.3) v2(40.98,89.9) v2(40.98,88.5) v2(40.98,87.1) v2(40.98,85.7) v2(40.98,7.3) v2(40.98,5.9) v2(40.98,4.5) v2(40.98,3.1) v2(40.98,1.7) v2(41.53,40.72) v2(41.53,40.02) v2(41.53,39.32) v2(41.53,38.62) v2(41.53,37.92) v2(41.53,37.22) v2(41.53,36.52) v2(41.53,35.82) v2(41.53,35.12) v2(41.53,34.42) v2(41.53,33.72) v2(41.53,33.02) v2(41.53,32.32) v2(41.53,31.62) v2(41.53,30.92) v2(41.53,30.22) v2(41.53,29.52) v2(41.53,28.82) v2(41.53,28.12) v2(41.53,27.42) v2(41.53,26.72) v2(41.53,26.02) v2(41.53,25.32) v2(41.53,24.62) v2(41.53,23.92) v2(41.53,23.22) v2(41.53,22.52) v2(41.53,21.82) v2(41.53,21.12) v2(41.53,20.42) v2(41.53,19.72) v2(41.53,19.02) v2(41.53,18.32) v2(41.53,17.62) v2(41.53,16.92) v2(41.53,16.22) v2(41.53,15.52) v2(41.53,14.82) v2(41.53,14.12) v2(41.53,13.42) v2(41.53,12.72) v2(41.53,12.02) v2(41.53,11.32) v2(41.53,10.62) v2(41.53,9.92) v2(41.53,9.22) v2(41.53,8.52) v2(42.23,40.02) v2(42.23,39.32) v2(42.23,38.62) v2(42.23,37.92) v2(42.23,37.22) v2(42.23,36.52) v2(42.23,35.82) v2(42.23,35.12) v2(42.23,34.42) v2(42.23,33.72) v2(42.23,33.02) v2(42.23,32.32) v2(42.23,31.62) v2(42.23,30.92) v2(42.23,30.22) v2(42.23,29.52) v2(42.23,28.82) v2(42.23,28.12) v2(42.23,27.42) v2(42.23,26.72) v2(42.23,26.02) v2(42.23,25.32) v2(42.23,24.62) v2(42.23,23.92) v2(42.23,23.22) v2(42.23,22.52) v2(42.23,21.82) v2(42.23,21.12) v2(42.23,20.42) v2(42.23,19.72) v2(42.23,19.02) v2(42.23,18.32) v2(42.23,17.62) v2(42.23,16.92) v2(42.23,16.22) v2(42.23,15.52) v2(42.23,14.82) v2(42.23,14.12) v2(42.23,13.42) v2(42.23,12.72) v2(42.23,12.02) v2(42.23,11.32) v2(42.23,10.62) v2(42.23,9.92) v2(42.23,9.22) v2(42.23,8.52) v2(42.38,117.9) v2(42.38,116.5) v2(42.38,115.1) v2(42.38,113.7) v2(42.38,112.3) v2(42.38,110.9) v2(42.38,109.5) v2(42.38,108.1) v2(42.38,96.9) v2(42.38,95.5) v2(42.38,94.1) v2(42.38,92.7) v2(42.38,91.3) v2(42.38,89.9) v2(42.38,88.5) v2(42.38,87.1) v2(42.38,85.7) v2(42.38,49.3) v2(42.38,45.1) v2(42.38,7.3) v2(42.38,5.9) v2(42.38,4.5) v2(42.38,3.1) v2(42.38,1.7) v2(42.93,39.32) v2(42.93,38.62) v2(42.93,37.92) v2(42.93,37.22) v2(42.93,36.52) v2(42.93,35.82) v2(42.93,35.12) v2(42.93,34.42) v2(42.93,33.72) v2(42.93,33.02) v2(42.93,32.32) v2(42.93,31.62) v2(42.93,30.92) v2(42.93,30.22) v2(42.93,29.52) v2(42.93,28.82) v2(42.93,28.12) v2(42.93,27.42) v2(42.93,26.72) v2(42.93,26.02) v2(42.93,25.32) v2(42.93,24.62) v2(42.93,23.92) v2(42.93,23.22) v2(42.93,22.52) v2(42.93,21.82) v2(42.93,21.12) v2(42.93,20.42) v2(42.93,19.72) v2(42.93,19.02) v2(42.93,18.32) v2(42.93,17.62) v2(42.93,16.92) v2(42.93,16.22) v2(42.93,15.52) v2(42.93,14.82) v2(42.93,14.12) v2(42.93,13.42) v2(42.93,12.72) v2(42.93,12.02) v2(42.93,11.32) v2(42.93,10.62) v2(42.93,9.92) v2(42.93,9.22) v2(42.93,8.52) v2(43.63,38.62) v2(43.63,37.92) v2(43.63,37.22) v2(43.63,36.52) v2(43.63,35.82) v2(43.63,35.12) v2(43.63,34.42) v2(43.63,33.72) v2(43.63,33.02) v2(43.63,32.32) v2(43.63,31.62) v2(43.63,30.92) v2(43.63,30.22) v2(43.63,29.52) v2(43.63,28.82) v2(43.63,28.12) v2(43.63,27.42) v2(43.63,26.72) v2(43.63,26.02) v2(43.63,25.32) v2(43.63,24.62) v2(43.63,23.92) v2(43.63,23.22) v2(43.63,22.52) v2(43.63,21.82) v2(43.63,21.12) v2(43.63,20.42) v2(43.63,19.72) v2(43.63,19.02) v2(43.63,18.32) v2(43.63,17.62) v2(43.63,16.92) v2(43.63,16.22) v2(43.63,15.52) v2(43.63,14.82) v2(43.63,14.12) v2(43.63,13.42) v2(43.63,12.72) v2(43.63,12.02) v2(43.63,11.32) v2(43.63,10.62) v2(43.63,9.92) v2(43.63,9.22) v2(43.63,8.52) v2(43.78,117.9) v2(43.78,116.5) v2(43.78,115.1) v2(43.78,113.7) v2(43.78,112.3) v2(43.78,110.9) v2(43.78,109.5) v2(43.78,98.3) v2(43.78,96.9) v2(43.78,95.5) v2(43.78,94.1) v2(43.78,92.7) v2(43.78,91.3) v2(43.78,89.9) v2(43.78,88.5) v2(43.78,87.1) v2(43.78,82.9) v2(43.78,46.5) v2(43.78,43.7) v2(43.78,7.3) v2(43.78,5.9) v2(43.78,4.5) v2(43.78,3.1) v2(43.78,1.7) v2(44.33,37.92) v2(44.33,37.22) v2(44.33,36.52) v2(44.33,35.82) v2(44.33,35.12) v2(44.33,34.42) v2(44.33,33.72) v2(44.33,33.02) v2(44.33,32.32) v2(44.33,31.62) v2(44.33,30.92) v2(44.33,30.22) v2(44.33,29.52) v2(44.33,28.82) v2(44.33,28.12) v2(44.33,27.42) v2(44.33,26.72) v2(44.33,26.02) v2(44.33,25.32) v2(44.33,24.62) v2(44.33,23.92) v2(44.33,23.22) v2(44.33,22.52) v2(44.33,21.82) v2(44.33,21.12) v2(44.33,20.42) v2(44.33,19.72) v2(44.33,19.02) v2(44.33,18.32) v2(44.33,17.62) v2(44.33,16.92) v2(44.33,16.22) v2(44.33,15.52) v2(44.33,14.82) v2(44.33,14.12) v2(44.33,13.42) v2(44.33,12.72) v2(44.33,12.02) v2(44.33,11.32) v2(44.33,10.62) v2(44.33,9.92) v2(44.33,9.22) v2(44.33,8.52) v2(44.68,56.52) v2(45.03,37.22) v2(45.03,36.52) v2(45.03,35.82) v2(45.03,35.12) v2(45.03,34.42) v2(45.03,33.72) v2(45.03,33.02) v2(45.03,32.32) v2(45.03,31.62) v2(45.03,30.92) v2(45.03,30.22) v2(45.03,29.52) v2(45.03,28.82) v2(45.03,28.12) v2(45.03,27.42) v2(45.03,26.72) v2(45.03,26.02) v2(45.03,25.32) v2(45.03,24.62) v2(45.03,23.92) v2(45.03,23.22) v2(45.03,22.52) v2(45.03,21.82) v2(45.03,21.12) v2(45.03,20.42) v2(45.03,19.72) v2(45.03,19.02) v2(45.03,18.32) v2(45.03,17.62) v2(45.03,16.92) v2(45.03,16.22) v2(45.03,15.52) v2(45.03,14.82) v2(45.03,14.12) v2(45.03,13.42) v2(45.03,12.72) v2(45.03,12.02) v2(45.03,11.32) v2(45.03,10.62) v2(45.03,9.92) v2(45.03,9.22) v2(45.03,8.52) v2(45.18,119.3) v2(45.18,117.9) v2(45.18,116.5) v2(45.18,115.1) v2(45.18,113.7) v2(45.18,112.3) v2(45.18,110.9) v2(45.18,98.3) v2(45.18,96.9) v2(45.18,95.5) v2(45.18,94.1) v2(45.18,92.7) v2(45.18,91.3) v2(45.18,89.9) v2(45.18,88.5) v2(45.18,82.9) v2(45.18,47.9) v2(45.18,46.5) v2(45.18,43.7) v2(45.18,42.3) v2(45.18,4.5) v2(45.18,3.1) v2(45.18,1.7) v2(45.73,40.02) v2(45.73,36.52) v2(45.73,35.82) v2(45.73,35.12) v2(45.73,34.42) v2(45.73,33.72) v2(45.73,33.02) v2(45.73,32.32) v2(45.73,31.62) v2(45.73,30.92) v2(45.73,30.22) v2(45.73,29.52) v2(45.73,28.82) v2(45.73,28.12) v2(45.73,27.42) v2(45.73,26.72) v2(45.73,26.02) v2(45.73,25.32) v2(45.73,24.62) v2(45.73,23.92) v2(45.73,23.22) v2(45.73,22.52) v2(45.73,21.82) v2(45.73,21.12) v2(45.73,20.42) v2(45.73,19.72) v2(45.73,19.02) v2(45.73,18.32) v2(45.73,17.62) v2(45.73,16.92) v2(45.73,16.22) v2(45.73,15.52) v2(45.73,14.82) v2(45.73,14.12) v2(45.73,13.42) v2(45.73,12.72) v2(45.73,12.02) v2(45.73,11.32) v2(45.73,10.62) v2(45.73,9.92) v2(45.73,9.22) v2(45.73,8.52) v2(46.12,103.83) v2(46.43,40.02) v2(46.43,39.32) v2(46.43,35.82) v2(46.43,35.12) v2(46.43,34.42) v2(46.43,33.72) v2(46.43,33.02) v2(46.43,32.32) v2(46.43,31.62) v2(46.43,30.92) v2(46.43,30.22) v2(46.43,29.52) v2(46.43,28.82) v2(46.43,28.12) v2(46.43,27.42) v2(46.43,26.72) v2(46.43,26.02) v2(46.43,25.32) v2(46.43,24.62) v2(46.43,23.92) v2(46.43,23.22) v2(46.43,22.52) v2(46.43,21.82) v2(46.43,21.12) v2(46.43,20.42) v2(46.43,19.72) v2(46.43,19.02) v2(46.43,18.32) v2(46.43,17.62) v2(46.43,16.92) v2(46.43,16.22) v2(46.43,15.52) v2(46.43,14.82) v2(46.43,14.12) v2(46.43,13.42) v2(46.43,12.72) v2(46.43,12.02) v2(46.43,11.32) v2(46.43,10.62) v2(46.43,9.92) v2(46.43,9.22) v2(46.43,8.52) v2(46.58,119.3) v2(46.58,117.9) v2(46.58,116.5) v2(46.58,115.1) v2(46.58,101.1) v2(46.58,98.3) v2(46.58,96.9) v2(46.58,95.5) v2(46.58,94.1) v2(46.58,92.7) v2(46.58,91.3) v2(46.58,89.9) v2(46.58,85.7) v2(46.58,53.5) v2(46.58,49.3) v2(46.58,47.9) v2(46.58,46.5) v2(46.58,43.7) v2(46.58,42.3) v2(46.58,4.5) v2(46.58,3.1) v2(46.58,1.7) v2(47.13,40.02) v2(47.13,39.32) v2(47.13,38.62) v2(47.13,35.12) v2(47.13,34.42) v2(47.13,33.72) v2(47.13,33.02) v2(47.13,32.32) v2(47.13,31.62) v2(47.13,30.92) v2(47.13,30.22) v2(47.13,29.52) v2(47.13,28.82) v2(47.13,28.12) v2(47.13,27.42) v2(47.13,26.72) v2(47.13,26.02) v2(47.13,25.32) v2(47.13,24.62) v2(47.13,23.92) v2(47.13,23.22) v2(47.13,22.52) v2(47.13,21.82) v2(47.13,21.12) v2(47.13,20.42) v2(47.13,19.72) v2(47.13,19.02) v2(47.13,18.32) v2(47.13,17.62) v2(47.13,16.92) v2(47.13,16.22) v2(47.13,15.52) v2(47.13,14.82) v2(47.13,14.12) v2(47.13,13.42) v2(47.13,12.72) v2(47.13,12.02) v2(47.13,11.32) v2(47.13,10.62) v2(47.13,9.92) v2(47.13,9.22) v2(47.52,112.23) v2(47.83,40.02) v2(47.83,39.32) v2(47.83,38.62) v2(47.83,37.92) v2(47.83,34.42) v2(47.83,33.72) v2(47.83,33.02) v2(47.83,32.32) v2(47.83,31.62) v2(47.83,30.92) v2(47.83,30.22) v2(47.83,29.52) v2(47.83,28.82) v2(47.83,28.12) v2(47.83,27.42) v2(47.83,26.72) v2(47.83,26.02) v2(47.83,25.32) v2(47.83,24.62) v2(47.83,23.92) v2(47.83,23.22) v2(47.83,22.52) v2(47.83,21.82) v2(47.83,21.12) v2(47.83,20.42) v2(47.83,19.72) v2(47.83,19.02) v2(47.83,18.32) v2(47.83,17.62) v2(47.83,16.92) v2(47.83,16.22) v2(47.83,15.52) v2(47.83,14.82) v2(47.83,14.12) v2(47.83,13.42) v2(47.83,12.72) v2(47.83,12.02) v2(47.83,11.32) v2(47.83,10.62) v2(47.83,9.92) v2(47.98,117.9) v2(47.98,116.5) v2(47.98,115.1) v2(47.98,113.7) v2(47.98,101.1) v2(47.98,98.3) v2(47.98,96.9) v2(47.98,95.5) v2(47.98,94.1) v2(47.98,92.7) v2(47.98,91.3) v2(47.98,81.5) v2(47.98,54.9) v2(47.98,50.7) v2(47.98,49.3) v2(47.98,47.9) v2(47.98,46.5) v2(47.98,43.7) v2(47.98,42.3) v2(47.98,4.5) v2(47.98,3.1) v2(47.98,1.7) v2(48.92,110.83) v2(48.92,106.63) v2(49.38,117.9) v2(49.38,116.5) v2(49.38,113.7) v2(49.38,102.5) v2(49.38,101.1) v2(49.38,98.3) v2(49.38,96.9) v2(49.38,95.5) v2(49.38,94.1) v2(49.38,92.7) v2(49.38,89.9) v2(49.38,8.7) v2(49.38,4.5) v2(49.38,3.1) v2(49.38,1.7) v2(50.78,117.9) v2(50.78,113.7) v2(50.78,112.3) v2(50.78,110.9) v2(50.78,105.3) v2(50.78,102.5) v2(50.78,101.1) v2(50.78,98.3) v2(50.78,96.9) v2(50.78,95.5) v2(50.78,94.1) v2(50.78,91.3) v2(50.78,89.9) v2(50.78,49.3) v2(50.78,47.9) v2(50.78,46.5) v2(50.78,45.1) v2(50.78,43.7) v2(50.78,42.3) v2(50.78,17.1) v2(50.78,15.7) v2(50.78,12.9) v2(50.78,11.5) v2(50.78,10.1) v2(50.78,8.7) v2(50.78,7.3) v2(50.78,5.9) v2(50.78,4.5) v2(50.78,3.1) v2(50.78,1.7) v2(52.18,117.9) v2(52.18,116.5) v2(52.18,115.1) v2(52.18,113.7) v2(52.18,112.3) v2(52.18,110.9) v2(52.18,109.5) v2(52.18,108.1) v2(52.18,106.7) v2(52.18,105.3) v2(52.18,103.9) v2(52.18,102.5) v2(52.18,101.1) v2(52.18,98.3) v2(52.18,96.9) v2(52.18,88.5) v2(52.18,84.3) v2(52.18,26.9) v2(52.18,18.5) v2(52.18,15.7) v2(52.18,14.3) v2(52.18,11.5) v2(52.18,10.1) v2(52.18,8.7) v2(52.18,7.3) v2(52.18,5.9) v2(52.18,4.5) v2(52.18,3.1) v2(52.18,1.7) v2(53.58,119.3) v2(53.58,117.9) v2(53.58,116.5) v2(53.58,115.1) v2(53.58,113.7) v2(53.58,112.3) v2(53.58,110.9) v2(53.58,109.5) v2(53.58,108.1) v2(53.58,106.7) v2(53.58,105.3) v2(53.58,103.9) v2(53.58,102.5) v2(53.58,101.1) v2(53.58,19.9) v2(53.58,12.9) v2(53.58,8.7) v2(53.58,7.3) v2(53.58,5.9) v2(53.58,4.5) v2(53.58,3.1) v2(53.58,1.7) v2(54.98,117.9) v2(54.98,116.5) v2(54.98,115.1) v2(54.98,113.7) v2(54.98,112.3) v2(54.98,110.9) v2(54.98,109.5) v2(54.98,108.1) v2(54.98,106.7) v2(54.98,105.3) v2(54.98,103.9) v2(54.98,102.5) v2(54.98,101.1) v2(54.98,82.9) v2(54.98,81.5) v2(54.98,63.3) v2(54.98,61.9) v2(54.98,47.9) v2(54.98,43.7) v2(54.98,42.3) v2(54.98,40.9) v2(54.98,39.5) v2(54.98,38.1) v2(54.98,36.7) v2(54.98,35.3) v2(54.98,33.9) v2(54.98,32.5) v2(54.98,31.1) v2(54.98,29.7) v2(54.98,28.3) v2(54.98,26.9) v2(54.98,25.5) v2(54.98,24.1) v2(54.98,21.3) v2(54.98,19.9) v2(54.98,12.9) v2(54.98,8.7) v2(54.98,7.3) v2(54.98,5.9) v2(54.98,4.5) v2(54.98,3.1) v2(54.98,1.7) v2(56.38,117.9) v2(56.38,116.5) v2(56.38,115.1) v2(56.38,113.7) v2(56.38,112.3) v2(56.38,110.9) v2(56.38,109.5) v2(56.38,108.1) v2(56.38,106.7) v2(56.38,105.3) v2(56.38,103.9) v2(56.38,102.5) v2(56.38,101.1) v2(56.38,99.7) v2(56.38,98.3) v2(56.38,96.9) v2(56.38,87.1) v2(56.38,82.9) v2(56.38,81.5) v2(56.38,80.1) v2(56.38,75.9) v2(56.38,47.9) v2(56.38,46.5) v2(56.38,42.3) v2(56.38,40.9) v2(56.38,39.5) v2(56.38,38.1) v2(56.38,36.7) v2(56.38,35.3) v2(56.38,33.9) v2(56.38,32.5) v2(56.38,31.1) v2(56.38,29.7) v2(56.38,28.3) v2(56.38,26.9) v2(56.38,25.5) v2(56.38,24.1) v2(56.38,22.7) v2(56.38,21.3) v2(56.38,19.9) v2(56.38,18.5) v2(56.38,17.1) v2(56.38,15.7) v2(56.38,14.3) v2(56.38,12.9) v2(56.38,11.5) v2(56.38,10.1) v2(56.38,8.7) v2(56.38,7.3) v2(56.38,5.9) v2(56.38,1.7) v2(57.78,119.3) v2(57.78,117.9) v2(57.78,116.5) v2(57.78,115.1) v2(57.78,113.7) v2(57.78,112.3) v2(57.78,110.9) v2(57.78,109.5) v2(57.78,108.1) v2(57.78,106.7) v2(57.78,105.3) v2(57.78,103.9) v2(57.78,102.5) v2(57.78,101.1) v2(57.78,99.7) v2(57.78,98.3) v2(57.78,94.1) v2(57.78,89.9) v2(57.78,88.5) v2(57.78,85.7) v2(57.78,84.3) v2(57.78,64.7) v2(57.78,63.3) v2(57.78,61.9) v2(57.78,42.3) v2(57.78,40.9) v2(57.78,39.5) v2(57.78,38.1) v2(57.78,36.7) v2(57.78,35.3) v2(57.78,33.9) v2(57.78,32.5) v2(57.78,31.1) v2(57.78,29.7) v2(57.78,28.3) v2(57.78,26.9) v2(57.78,25.5) v2(57.78,24.1) v2(57.78,22.7) v2(57.78,21.3) v2(57.78,19.9) v2(57.78,18.5) v2(57.78,17.1) v2(57.78,15.7) v2(57.78,14.3) v2(57.78,12.9) v2(57.78,11.5) v2(57.78,10.1) v2(57.78,8.7) v2(57.78,7.3) v2(57.78,5.9) v2(59.18,117.9) v2(59.18,113.7) v2(59.18,112.3) v2(59.18,110.9) v2(59.18,109.5) v2(59.18,108.1) v2(59.18,106.7) v2(59.18,105.3) v2(59.18,102.5) v2(59.18,101.1) v2(59.18,92.7) v2(59.18,91.3) v2(59.18,53.5) v2(59.18,47.9) v2(59.18,45.1) v2(59.18,43.7) v2(59.18,42.3) v2(59.18,40.9) v2(59.18,39.5) v2(59.18,38.1) v2(59.18,36.7) v2(59.18,35.3) v2(59.18,33.9) v2(59.18,32.5) v2(59.18,31.1) v2(59.18,29.7) v2(59.18,28.3) v2(59.18,26.9) v2(59.18,25.5) v2(59.18,24.1) v2(59.18,22.7) v2(59.18,21.3) v2(59.18,19.9) v2(59.18,18.5) v2(59.18,17.1) v2(59.18,15.7) v2(59.18,14.3) v2(59.18,12.9) v2(59.18,11.5) v2(59.18,10.1) v2(59.18,8.7) v2(59.18,7.3) v2(59.18,5.9) v2(59.18,1.7) v3(30.95,114.35) v3(31,115.6) v3(31.27,116.25) v3(31.26,115.04) v3(31.55,114.44) v3(31.74,119.59) v3(31.73,118.96) v3(31.73,118.32) v3(31.73,112.12) v3(31.81,115.65) v3(31.86,112.8) v3(31.97,116.86) v3(31.89,116.26) v3(31.89,114.94) v3(32.25,119.27) v3(32.26,118.66) v3(32.27,118.03) v3(32.24,117.42) v3(32.23,111.62) v3(32.35,113.72) v3(32.33,112.22) v3(32.53,112.82) v3(32.67,116.99) v3(32.7,114.24) v3(32.83,111.32) v3(32.93,111.94) v3(33.03,113.62) v3(33.13,116.01) v3(33.13,115.41) v3(33.12,114.79) v3(33.13,113.02) v3(33.33,114.22) v3(33.53,116.57) v3(33.65,118.26) v3(33.63,113.62) v3(33.75,119.62) v3(33.73,115.32) v3(33.85,118.94) v3(33.83,116.02) v3(33.83,114.62) v3(33.89,117.09) v3(34.03,117.74) v3(34.14,114) v3(34.33,116.62) v3(34.43,119.62) v3(34.4,115.32) v3(34.5,118.82) v3(34.53,117.32) v3(34.53,116.02) v3(34.6,118.08) v3(34.63,114.62) v3(35.03,119.32) v3(35.13,118.52) v3(35.13,117.12) v3(35.23,117.82) v4(43.43,99.92)
